# EAGLE board A33 MINI TABLET (EAGLE 9.6.2), part 1 of 4
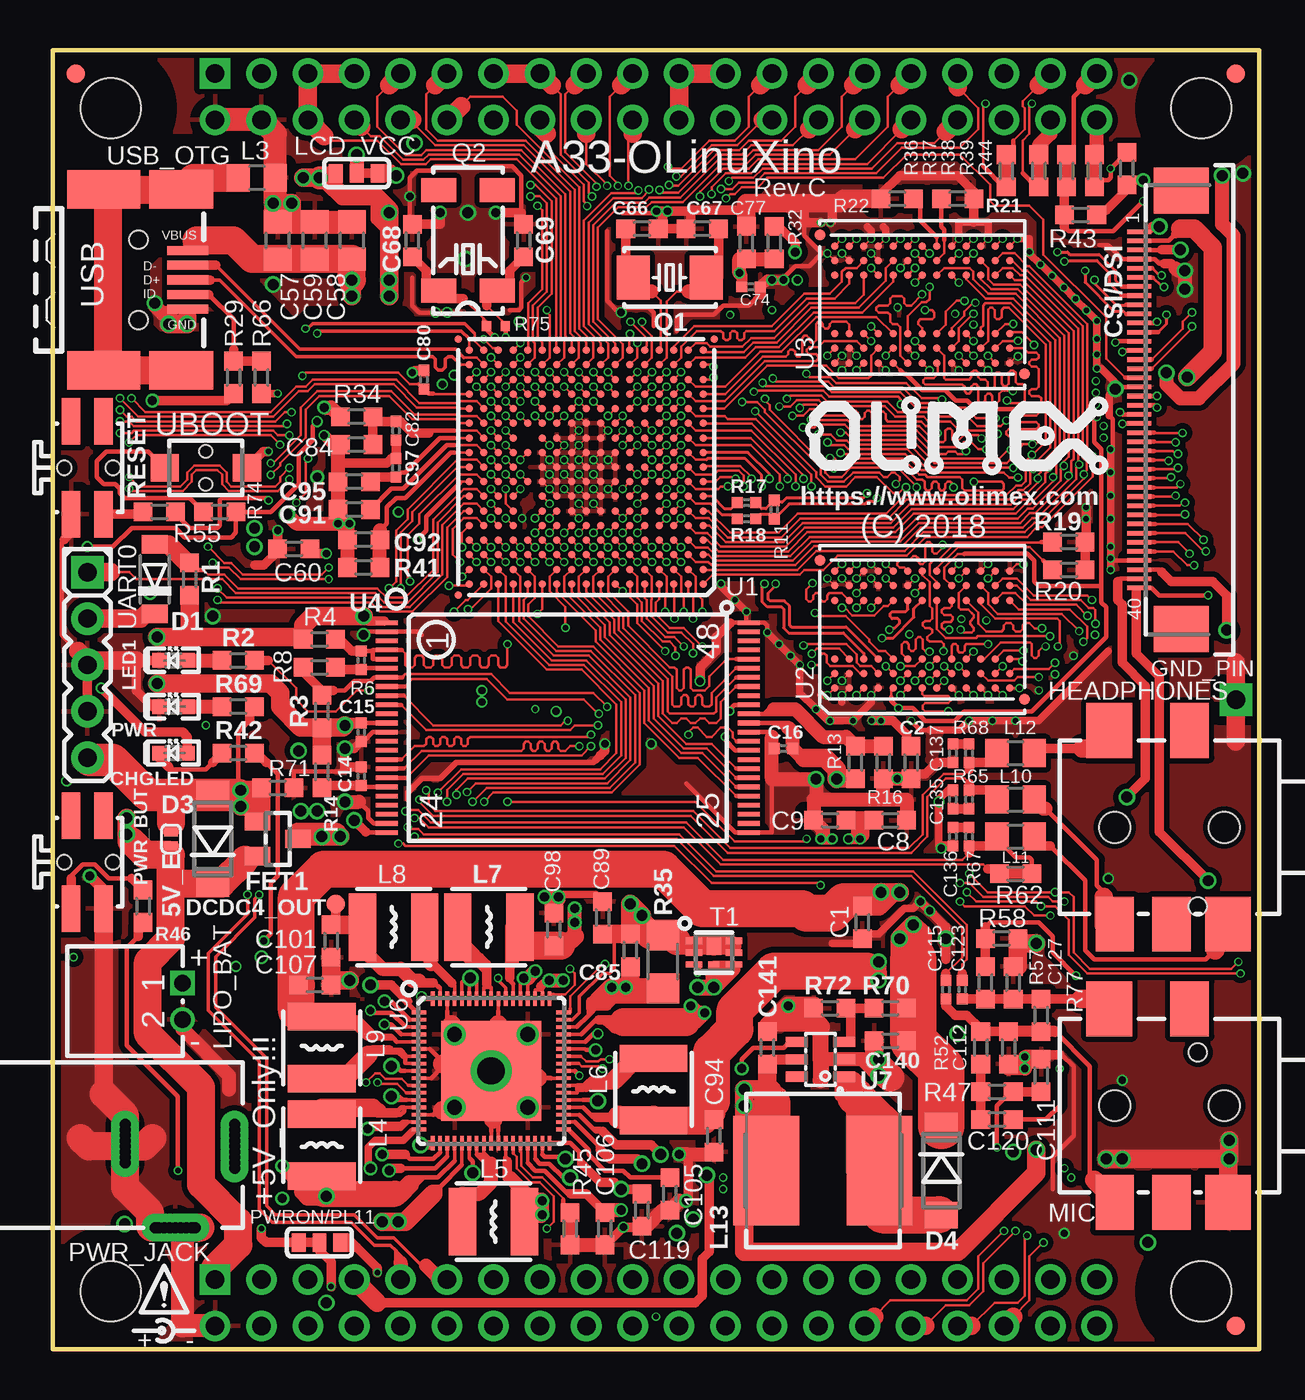
[diagram p5: board, top side]
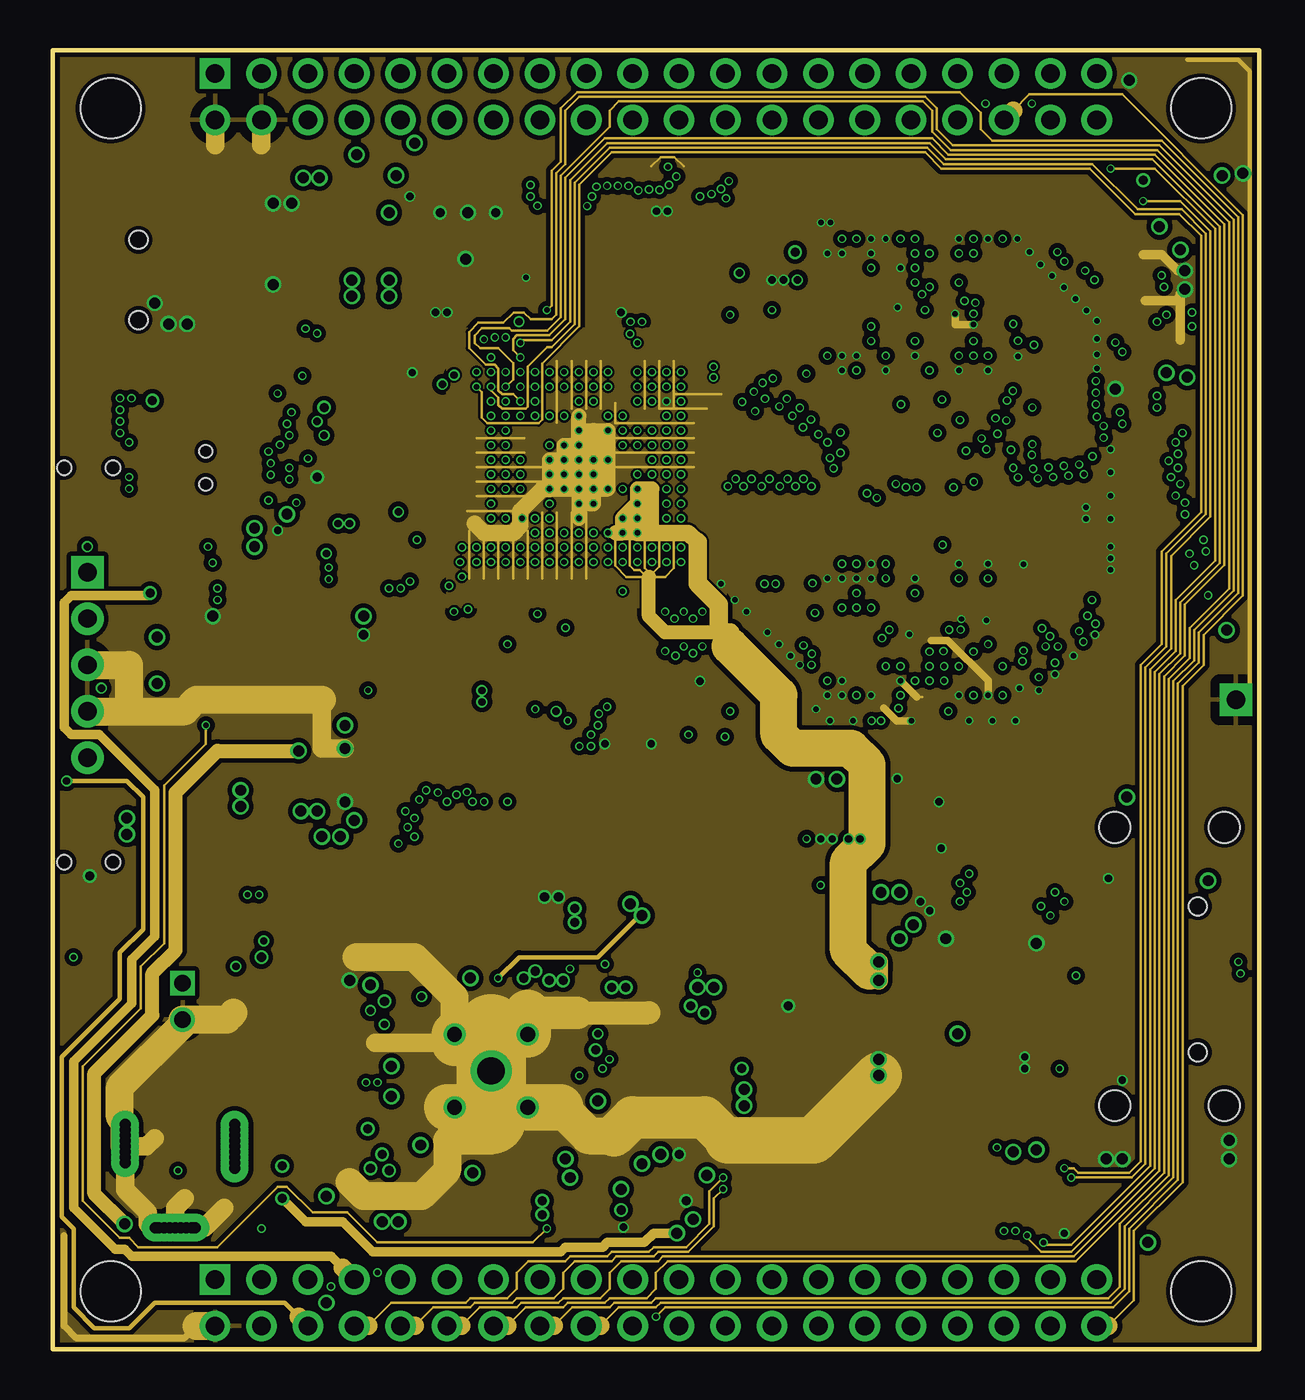
[diagram p6: board, inner layer GND]
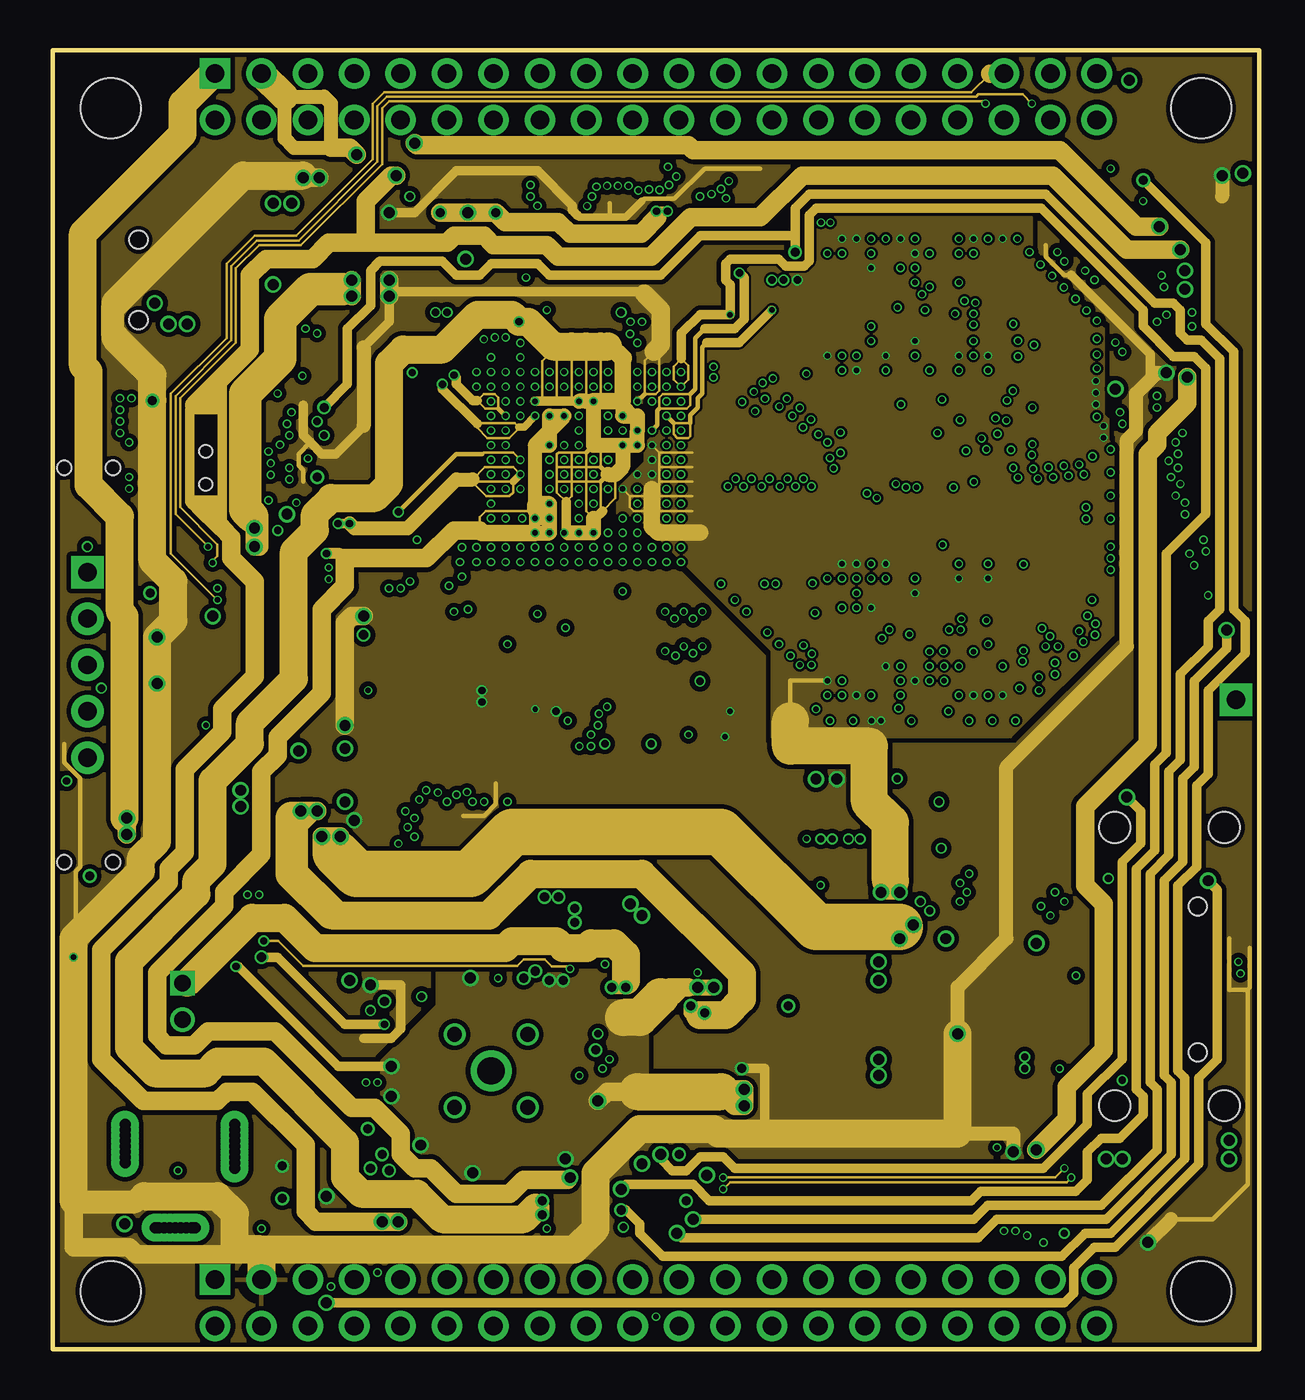
[diagram p7: board, inner layer PWR]
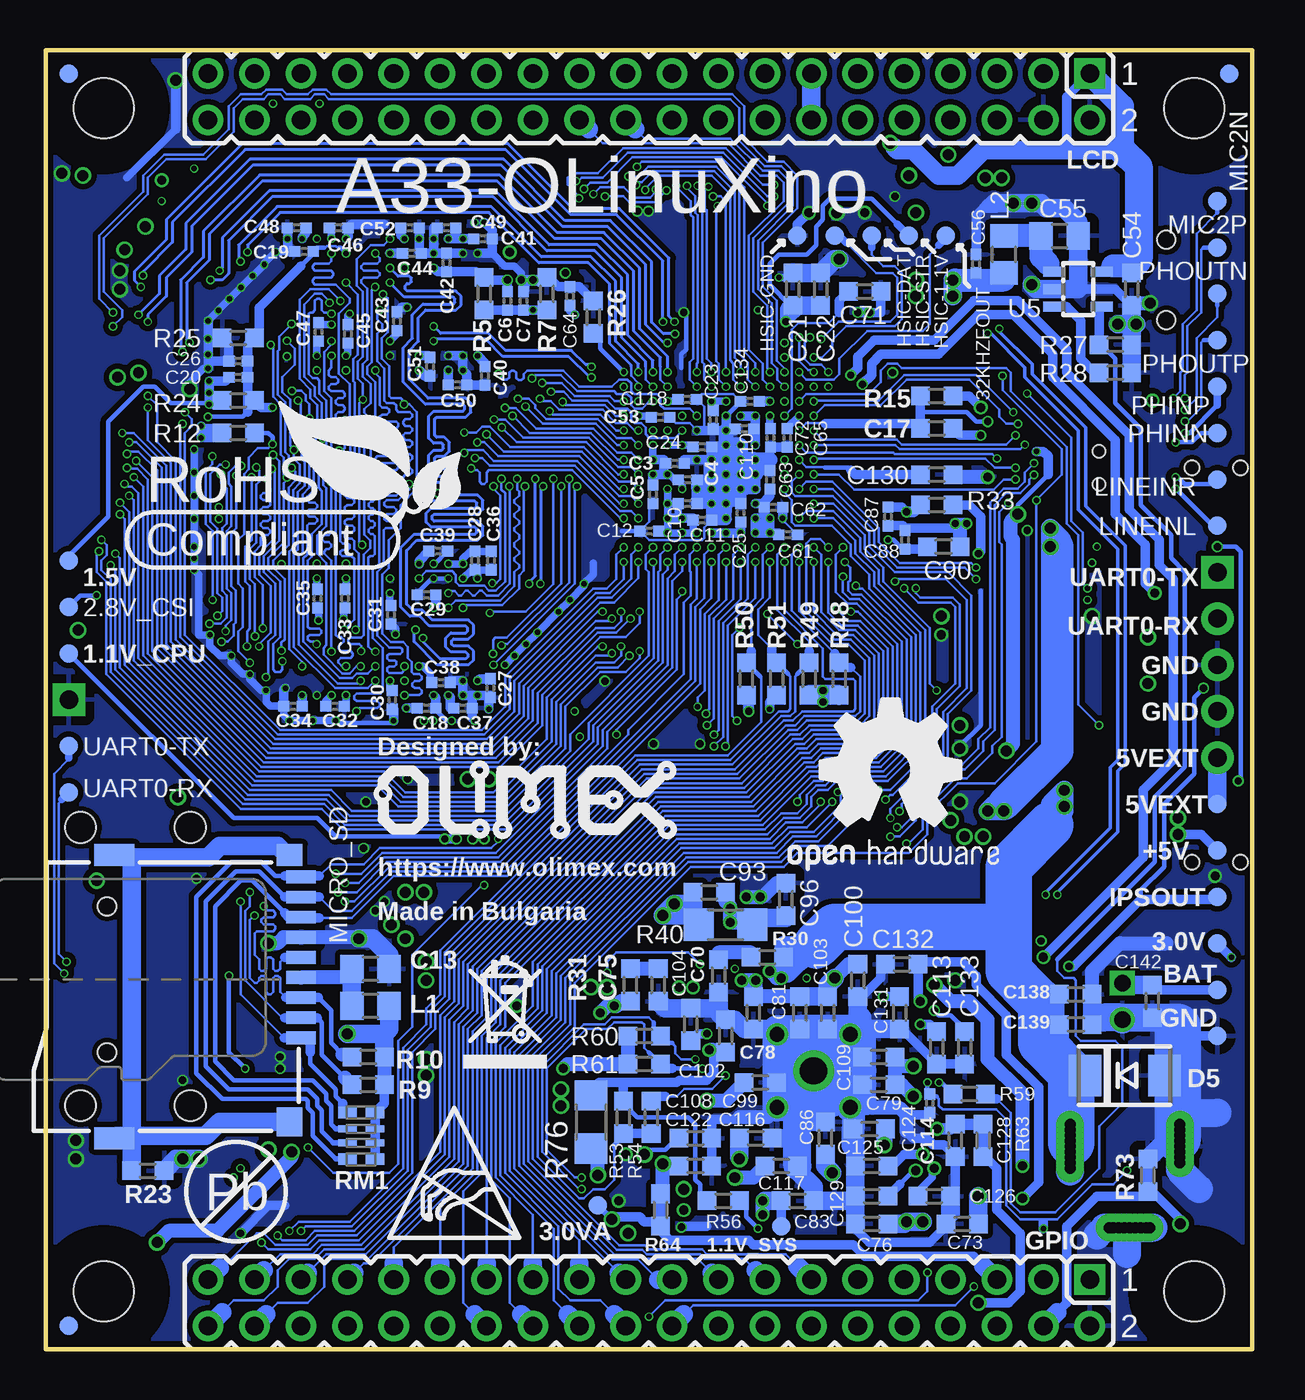
[diagram p8: board, bottom side, seen from below]

Size 66.04 x 71.12 mm. Coordinates in mm from the lower left corner, seen from the top.
Outline: 0,71.12 0,0 66.04,0 66.04,71.12 0,71.12
Copper layers (1+2*15+16): Top 0.035mm / dielectric 5mil / GND 0.035mm / dielectric 1.1mm / PWR 0.035mm / dielectric 5mil / Bottom 0.035mm
Design rules "default": minimum track width 4mil, minimum drill 0.3mm, track to track 5mil, track to pad 5mil, pad to pad 5mil, via to via 5mil, smd to smd 1mil, copper to edge 10mil, drill to drill 8mil, minimum pad ring 8mil, minimum via ring 3mil, stop-mask expansion 4mil, vias tented up to drill 28mil, thermal gap 20mil
Holes 3.3 mm at 3.17,67.94 62.87,67.94 3.17,3.17 62.87,3.17
tRestrict: area 0,64.8 to 6.3,71.1; area 59.7,64.8 to 66,71.1; area 0,0 to 6.3,6.3; area 59.7,0 to 66,6.3; 30 lines
bRestrict: area 0,64.8 to 6.3,71.1; area 59.7,64.8 to 66,71.1; area 0,0 to 6.3,6.3; area 59.7,0 to 66,6.3; 5 lines

## Footprints (pad centres in the part's own frame; a part is rotated, then mirrored left to right if it is on the bottom)
TESTPAD_40-ROUND = smd 1.016 x 1.016: 1 0,0
SJ_1_SMALLER = smd 0.508 x 0.762: 1 -0.381,0; 2 0.381,0
C0603_DWS = smd 1.016 x 1.016: 1 -0.889,0; 2 0.889,0
C0402_TI = smd 0.61 x 0.584: 1 -0.508,0; 2 0.508,0
C0805_5MIL_DWS = smd 1.27 x 1.524: 1 -1.016,0; 2 1.016,0
LED-0603_TEST = smd 0.8 x 0.8: A 0.762,0; C -0.762,0
FPV-WZA21-40-LF = smd 0.25 x 1.3: 1 -9.75,-2.75; 2 -9.25,-2.75; 3 -8.75,-2.75; 4 -8.25,-2.75; 5 -7.75,-2.75; 6 -7.25,-2.75; 7 -6.75,-2.75; 8 -6.25,-2.75; 9 -5.75,-2.75; 10 -5.25,-2.75; 11 -4.75,-2.75; 12 -4.25,-2.75; 13 -3.75,-2.75; 14 -3.25,-2.75; 15 -2.75,-2.75; 16 -2.25,-2.75; 17 -1.75,-2.75; 18 -1.25,-2.75; 19 -0.75,-2.75; 20 -0.25,-2.75; 21 0.25,-2.75; 22 0.75,-2.75; 23 1.25,-2.75; 24 1.75,-2.75; 25 2.25,-2.75; 26 2.75,-2.75; 27 3.25,-2.75; 28 3.75,-2.75; 29 4.25,-2.75; 30 4.75,-2.75; 31 5.25,-2.75; 32 5.75,-2.75; 33 6.25,-2.75; 34 6.75,-2.75; 35 7.25,-2.75; 36 7.75,-2.75; 37 8.25,-2.75; 38 8.75,-2.75; 39 9.25,-2.75; 40 9.75,-2.75 | smd 2.5 x 3: P1 12,-0.45; P2 -12,-0.45
SOD-123 = smd 1 x 1.4: A 1.9,0; C -1.9,0
MLL-41 = smd 1.45 x 1.8: A 2.445,0; K -2.445,0
DO214AA = smd 1.778 x 2.286: A 2.177,0; C -2.177,0
SOT23 = smd 1.4 x 1: 1 1.1,-0.95; 2 1.1,0.95; 3 -1.1,0
TEST_PAD40/70/SQUARE = drill 1.016 pad 1.778 square: P$1 0,0
HN2X20-MALE = drill 1.016 pad 1.676 square: 1 -24.13,-1.27 | drill 1.016 pad 1.676: 2 -24.13,1.27; 3 -21.59,-1.27; 4 -21.59,1.27; 5 -19.05,-1.27; 6 -19.05,1.27; 7 -16.51,-1.27; 8 -16.51,1.27; 9 -13.97,-1.27; 10 -13.97,1.27; 11 -11.43,-1.27; 12 -11.43,1.27; 13 -8.89,-1.27; 14 -8.89,1.27; 15 -6.35,-1.27; 16 -6.35,1.27; 17 -3.81,-1.27; 18 -3.81,1.27; 19 -1.27,-1.27; 20 -1.27,1.27; 21 1.27,-1.27; 22 1.27,1.27; 23 3.81,-1.27; 24 3.81,1.27; 25 6.35,-1.27; 26 6.35,1.27; 27 8.89,-1.27; 28 8.89,1.27; 29 11.43,-1.27; 30 11.43,1.27; 31 13.97,-1.27; 32 13.97,1.27; 33 16.51,-1.27; 34 16.51,1.27; 35 19.05,-1.27; 36 19.05,1.27; 37 21.59,-1.27; 38 21.59,1.27; 39 24.13,-1.27; 40 24.13,1.27
SCJ325P00XG0B02G = smd 2.5 x 3: 1 6.3,-5.3; 2 -0.2,5.3 | smd 2.1 x 3: 3 6,5.3; 4 2.9,5.3; 5 1.9,-5.3 | hole 1.7: 0,0; 6,0
L0805_5MIL_DWS = smd 1.27 x 1.524: 1 -1.016,0; 2 1.016,0
SWPA4018S = smd 1.5 x 3.7: 1 -1.7,0; 2 1.7,0
8X8MM_3131 = smd 3.6 x 6: 1 -3.1,0; 2 3.1,0
SJ_2_SMALL_23_TIED = smd 0.762 x 1.016: 1 -1.143,0; 2 0,0; 3 1.143,0
DW02R = drill 0.9 square: 1 -1,0 | drill 0.9: 2 1,0
TFC-WPAPR-08 = smd 1.6 x 0.7: 1 -6.994,2.25; 2 -6.994,1.15; 3 -6.994,0.05; 4 -6.994,-1.05; 5 -6.994,-2.15; 6 -6.994,-3.25; 7 -6.994,-4.35; 8 -6.994,-5.45; 9 -6.994,-6.55 | smd 1.4 x 1.2: 10 -6.369,-7.75 | smd 1.4 x 1.6: 11 -6.369,6.85 | smd 2.2 x 1.2: 12 3.231,-7.75; 13 3.231,7.75 | hole 1: 3.631,-4.95; 3.631,3.05
SW_TAKT3X4 = smd 2.54 x 1.016: 1_1 2.54,-0.889; 1_2 -2.54,-0.889; 2_1 2.54,0.889; 2_2 -2.54,0.889 | hole 0.8: 0,1.397; 0,-1.27
PWR_JACK_UNI_MILLING = drill 0.6 pad 1.5: + -0.196,4.75; +1 -0.196,5.05; +2 -0.196,5.35; +3 -0.196,5.65; +4 -0.196,4.45; +5 -0.196,4.15; +6 -0.196,3.85; +7 -0.196,3.55; +8 -0.196,5.95; - -6.196,4.75; -1 -6.196,5.05; -2 -6.196,5.35; -3 -6.196,4.45; -4 -6.196,4.15; -5 -6.196,5.65; -6 -6.196,3.85; -8 -6.196,5.95; -- -3.446,0.3; --1 -3.746,0.3; --2 -4.046,0.3; --3 -4.346,0.3; --4 -3.146,0.3; --5 -2.846,0.3; --6 -2.546,0.3; --14 -4.546,0.3; --15 -2.346,0.3
SJ_2_SMALL_12_TIED = smd 0.762 x 1.016: 1 -1.143,0; 2 0,0; 3 1.143,0
HCX-4S = smd 1.8 x 2.4: 1 -2,0; 2 2,0
MC-306 = smd 1.3 x 1.9: 1 -2.75,-1.6; 2 2.75,-1.6; 3 2.75,1.6; 4 -2.75,1.6
R0603_5MIL_DWS = smd 1.016 x 1.016: 1 -0.889,0; 2 0.889,0
R0402_TI = smd 0.61 x 0.584: 1 -0.508,0; 2 0.508,0
R1206_5MIL_WS = smd 1.651 x 1.778: 1 -1.46,0; 2 1.46,0
0603_0R = smd 1.016 x 1.016: 1 -0.889,0; 2 0.889,0
R0402_SMALL = smd 0.5 x 0.55: 1 -0.508,0; 2 0.508,0
R1206_5MIL = smd 1.651 x 1.778: 1 -1.46,0; 2 1.46,0
R_MATRIX_4 = smd 0.635 x 1.016: 1.1 -1.27,-0.762; 1.2 -1.27,0.762; 4.1 1.27,-0.762; 4.2 1.27,0.762 | smd 0.381 x 1.016: 2.1 -0.381,-0.762; 2.2 -0.381,0.762; 3.1 0.381,-0.762; 3.2 0.381,0.762
DFN2*2-6L = smd 0.35 x 0.9: 1 -0.65,-1.1; 2 0,-1.1; 3 0.65,-1.1; 4 0.65,1.1; 5 0,1.1; 6 -0.65,1.1 | smd 0.95 x 0.8: 7 -0.35,0 | smd 0.35 x 0.6: 8 0.65,0
TFBGA282 = smd 0.4 x 0.4: A1 -6.4,-6.4; A2 -6.4,-5.6; A3 -6.4,-4.8; A4 -6.4,-4; A5 -6.4,-3.2; A6 -6.4,-2.4; A7 -6.4,-1.6; A8 -6.4,-0.8; A9 -6.4,0; A10 -6.4,0.8; A11 -6.4,1.6; A12 -6.4,2.4; A13 -6.4,3.2; A14 -6.4,4; A15 -6.4,4.8; A16 -6.4,5.6; A17 -6.4,6.4; B1 -5.6,-6.4; B2 -5.6,-5.6; B3 -5.6,-4.8; B4 -5.6,-4; B5 -5.6,-3.2; B6 -5.6,-2.4; B7 -5.6,-1.6; B8 -5.6,-0.8; B9 -5.6,0; B10 -5.6,0.8; B11 -5.6,1.6; B13 -5.6,3.2; B14 -5.6,4; B15 -5.6,4.8; B16 -5.6,5.6; B17 -5.6,6.4; C1 -4.8,-6.4; C2 -4.8,-5.6; C3 -4.8,-4.8; C4 -4.8,-4; C5 -4.8,-3.2; C6 -4.8,-2.4; C7 -4.8,-1.6; C8 -4.8,-0.8; C9 -4.8,0; C10 -4.8,0.8; C11 -4.8,1.6; C12 -4.8,2.4; C13 -4.8,3.2; C14 -4.8,4; C15 -4.8,4.8; C16 -4.8,5.6; C17 -4.8,6.4; D1 -4,-6.4; D2 -4,-5.6; D3 -4,-4.8; D4 -4,-4; D5 -4,-3.2; D6 -4,-2.4; D7 -4,-1.6; D8 -4,-0.8; D9 -4,0; D10 -4,0.8; D11 -4,1.6; D12 -4,2.4; D13 -4,3.2; D14 -4,4; D15 -4,4.8; D16 -4,5.6; D17 -4,6.4; E1 -3.2,-6.4; E2 -3.2,-5.6; E3 -3.2,-4.8; E4 -3.2,-4; E5 -3.2,-3.2; E6 -3.2,-2.4; E7 -3.2,-1.6; E8 -3.2,-0.8; E9 -3.2,0; E10 -3.2,0.8; E11 -3.2,1.6; E12 -3.2,2.4; E14 -3.2,4; E15 -3.2,4.8; E16 -3.2,5.6; E17 -3.2,6.4; F1 -2.4,-6.4; F2 -2.4,-5.6; F3 -2.4,-4.8; F4 -2.4,-4; F5 -2.4,-3.2; F6 -2.4,-2.4; F7 -2.4,-1.6; F8 -2.4,-0.8; F9 -2.4,0; F10 -2.4,0.8; F11 -2.4,1.6; F12 -2.4,2.4; F14 -2.4,4; F15 -2.4,4.8; F16 -2.4,5.6; F17 -2.4,6.4; FID1 7,-7; FID2 7,7; FID3 -7,7; G1 -1.6,-6.4; G2 -1.6,-5.6; G3 -1.6,-4.8; G4 -1.6,-4; G5 -1.6,-3.2; G6 -1.6,-2.4; G7 -1.6,-1.6; G8 -1.6,-0.8; G9 -1.6,0; G10 -1.6,0.8; G11 -1.6,1.6; G12 -1.6,2.4; G14 -1.6,4; G15 -1.6,4.8; G16 -1.6,5.6; G17 -1.6,6.4; H1 -0.8,-6.4; H2 -0.8,-5.6; H3 -0.8,-4.8; H4 -0.8,-4; H5 -0.8,-3.2; H6 -0.8,-2.4; H7 -0.8,-1.6; H8 -0.8,-0.8; H9 -0.8,0; H10 -0.8,0.8; H11 -0.8,1.6; H12 -0.8,2.4; H13 -0.8,3.2; H14 -0.8,4; H15 -0.8,4.8; H16 -0.8,5.6; H17 -0.8,6.4; J1 0,-6.4; J2 0,-5.6; J3 0,-4.8; J4 0,-4; J5 0,-3.2; J6 0,-2.4; J7 0,-1.6; J8 0,-0.8; J9 0,0; J10 0,0.8; J11 0,1.6; J12 0,2.4; J14 0,4; J15 0,4.8; J16 0,5.6; J17 0,6.4; K1 0.8,-6.4; K2 0.8,-5.6; K3 0.8,-4.8; K4 0.8,-4; K5 0.8,-3.2; K6 0.8,-2.4; K7 0.8,-1.6; K8 0.8,-0.8; K9 0.8,0; K10 0.8,0.8; K11 0.8,1.6; K12 0.8,2.4; K13 0.8,3.2; K14 0.8,4; K15 0.8,4.8; K16 0.8,5.6; K17 0.8,6.4; L1 1.6,-6.4; L2 1.6,-5.6; L3 1.6,-4.8; L4 1.6,-4; L5 1.6,-3.2; L6 1.6,-2.4; L7 1.6,-1.6; L8 1.6,-0.8; L9 1.6,0; L10 1.6,0.8; L11 1.6,1.6; L12 1.6,2.4; L14 1.6,4; L15 1.6,4.8; L16 1.6,5.6; L17 1.6,6.4; M1 2.4,-6.4; M2 2.4,-5.6; M3 2.4,-4.8; M4 2.4,-4; M5 2.4,-3.2; M6 2.4,-2.4; M7 2.4,-1.6; M8 2.4,-0.8; M9 2.4,0; M10 2.4,0.8; M11 2.4,1.6; M12 2.4,2.4; M13 2.4,3.2; M14 2.4,4; M15 2.4,4.8; M16 2.4,5.6; M17 2.4,6.4; N1 3.2,-6.4; N2 3.2,-5.6; N3 3.2,-4.8; N4 3.2,-4; N5 3.2,-3.2; N6 3.2,-2.4; N7 3.2,-1.6; N8 3.2,-0.8; N9 3.2,0; N10 3.2,0.8; N11 3.2,1.6; N12 3.2,2.4; N14 3.2,4; N15 3.2,4.8; N16 3.2,5.6; N17 3.2,6.4; P1 4,-6.4; P2 4,-5.6; P3 4,-4.8; P4 4,-4; P5 4,-3.2; P6 4,-2.4; P7 4,-1.6; P8 4,-0.8; P9 4,0; P10 4,0.8; P11 4,1.6; P12 4,2.4; P13 4,3.2; P14 4,4; P15 4,4.8; P16 4,5.6; P17 4,6.4; R1 4.8,-6.4; R2 4.8,-5.6; R3 4.8,-4.8; R4 4.8,-4; R5 4.8,-3.2; R6 4.8,-2.4; R7 4.8,-1.6; R8 4.8,-0.8; R9 4.8,0; R10 4.8,0.8; R11 4.8,1.6; R12 4.8,2.4; R13 4.8,3.2; R14 4.8,4; R15 4.8,4.8; R16 4.8,5.6; R17 4.8,6.4; T1 5.6,-6.4; T2 5.6,-5.6; T3 5.6,-4.8; T4 5.6,-4; T5 5.6,-3.2; T6 5.6,-2.4; T7 5.6,-1.6; T8 5.6,-0.8; T9 5.6,0; T10 5.6,0.8; T11 5.6,1.6; T12 5.6,2.4; T13 5.6,3.2; T14 5.6,4; T15 5.6,4.8; T16 5.6,5.6; T17 5.6,6.4; U1 6.4,-6.4; U2 6.4,-5.6; U3 6.4,-4.8; U4 6.4,-4; U5 6.4,-3.2; U6 6.4,-2.4; U7 6.4,-1.6; U8 6.4,-0.8; U9 6.4,0; U10 6.4,0.8; U11 6.4,1.6; U12 6.4,2.4; U13 6.4,3.2; U14 6.4,4; U15 6.4,4.8; U16 6.4,5.6; U17 6.4,6.4
FBGA78 = smd 0.4 x 0.4: A1 -4.8,-3.2; A2 -4.8,-2.4; A3 -4.8,-1.6; A7 -4.8,1.6; A8 -4.8,2.4; A9 -4.8,3.2; B1 -4,-3.2; B2 -4,-2.4; B3 -4,-1.6; B7 -4,1.6; B8 -4,2.4; B9 -4,3.2; C1 -3.2,-3.2; C2 -3.2,-2.4; C3 -3.2,-1.6; C7 -3.2,1.6; C8 -3.2,2.4; C9 -3.2,3.2; D1 -2.4,-3.2; D2 -2.4,-2.4; D3 -2.4,-1.6; D7 -2.4,1.6; D8 -2.4,2.4; D9 -2.4,3.2; E1 -1.6,-3.2; E2 -1.6,-2.4; E3 -1.6,-1.6; E7 -1.6,1.6; E8 -1.6,2.4; E9 -1.6,3.2; F1 -0.8,-3.2; F2 -0.8,-2.4; F3 -0.8,-1.6; F7 -0.8,1.6; F8 -0.8,2.4; F9 -0.8,3.2; G1 0,-3.2; G2 0,-2.4; G3 0,-1.6; G7 0,1.6; G8 0,2.4; G9 0,3.2; H1 0.8,-3.2; H2 0.8,-2.4; H3 0.8,-1.6; H7 0.8,1.6; H8 0.8,2.4; H9 0.8,3.2; J1 1.6,-3.2; J2 1.6,-2.4; J3 1.6,-1.6; J7 1.6,1.6; J8 1.6,2.4; J9 1.6,3.2; K1 2.4,-3.2; K2 2.4,-2.4; K3 2.4,-1.6; K7 2.4,1.6; K8 2.4,2.4; K9 2.4,3.2; L1 3.2,-3.2; L2 3.2,-2.4; L3 3.2,-1.6; L7 3.2,1.6; L8 3.2,2.4; L9 3.2,3.2; M1 4,-3.2; M2 4,-2.4; M3 4,-1.6; M7 4,1.6; M8 4,2.4; M9 4,3.2; N1 4.8,-3.2; N2 4.8,-2.4; N3 4.8,-1.6; N7 4.8,1.6; N8 4.8,2.4; N9 4.8,3.2 | smd 0.6 x 0.6: FID1 5.6,-3.8; FID2 -5.6,3.8
TSOP48 = smd 1.2 x 0.25: 1 -9.9,5.75; 2 -9.9,5.25; 3 -9.9,4.75; 4 -9.9,4.25; 5 -9.9,3.75; 6 -9.9,3.25; 7 -9.9,2.75; 8 -9.9,2.25; 9 -9.9,1.75; 10 -9.9,1.25; 11 -9.9,0.75; 12 -9.9,0.25; 13 -9.9,-0.25; 14 -9.9,-0.75; 15 -9.9,-1.25; 16 -9.9,-1.75; 17 -9.9,-2.25; 18 -9.9,-2.75; 19 -9.9,-3.25; 20 -9.9,-3.75; 21 -9.9,-4.25; 22 -9.9,-4.75; 23 -9.9,-5.25; 24 -9.9,-5.75; 25 9.9,-5.75; 26 9.9,-5.25; 27 9.9,-4.75; 28 9.9,-4.25; 29 9.9,-3.75; 30 9.9,-3.25; 31 9.9,-2.75; 32 9.9,-2.25; 33 9.9,-1.75; 34 9.9,-1.25; 35 9.9,-0.75; 36 9.9,-0.25; 37 9.9,0.25; 38 9.9,0.75; 39 9.9,1.25; 40 9.9,1.75; 41 9.9,2.25; 42 9.9,2.75; 43 9.9,3.25; 44 9.9,3.75; 45 9.9,4.25; 46 9.9,4.75; 47 9.9,5.25; 48 9.9,5.75
SOT23-5 = smd 1.2 x 0.55: 1 1.3,-0.95; 2 1.3,0; 3 1.3,0.95; 4 -1.3,0.95; 5 -1.3,-0.95
QFN68-8X8-04 = smd 0.2 x 0.8: 1 -3.2,-3.95; 2 -2.8,-3.95; 3 -2.4,-3.95; 4 -2,-3.95; 5 -1.6,-3.95; 6 -1.2,-3.95; 7 -0.8,-3.95; 8 -0.4,-3.95; 9 0,-3.95; 10 0.4,-3.95; 11 0.8,-3.95; 12 1.2,-3.95; 13 1.6,-3.95; 14 2,-3.95; 15 2.4,-3.95; 16 2.8,-3.95; 17 3.2,-3.95; 35 3.2,3.95; 36 2.8,3.95; 37 2.4,3.95; 38 2,3.95; 39 1.6,3.95; 40 1.2,3.95; 41 0.8,3.95; 42 0.4,3.95; 43 0,3.95; 44 -0.4,3.95; 45 -0.8,3.95; 46 -1.2,3.95; 47 -1.6,3.95; 48 -2,3.95; 49 -2.4,3.95; 50 -2.8,3.95; 51 -3.2,3.95 | smd 0.8 x 0.2: 18 3.95,-3.2; 19 3.95,-2.8; 20 3.95,-2.4; 21 3.95,-2; 22 3.95,-1.6; 23 3.95,-1.2; 24 3.95,-0.8; 25 3.95,-0.4; 26 3.95,0; 27 3.95,0.4; 28 3.95,0.8; 29 3.95,1.2; 30 3.95,1.6; 31 3.95,2; 32 3.95,2.4; 33 3.95,2.8; 34 3.95,3.2; 52 -3.95,3.2; 53 -3.95,2.8; 54 -3.95,2.4; 55 -3.95,2; 56 -3.95,1.6; 57 -3.95,1.2; 58 -3.95,0.8; 59 -3.95,0.4; 60 -3.95,0; 61 -3.95,-0.4; 62 -3.95,-0.8; 63 -3.95,-1.2; 64 -3.95,-1.6; 65 -3.95,-2; 66 -3.95,-2.4; 67 -3.95,-2.8; 68 -3.95,-3.2 | smd 5.49 x 5.49: GND 0,0 | drill 1.5: GND1 0,0 | drill 0.8: GND2 -2,-2; GND3 -2,2; GND4 2,2; GND5 2,-2
SOT23-6 = smd 1.2 x 0.55: 1 1.3,-0.95; 2 1.3,0; 3 1.3,0.95; 4 -1.3,0.95; 5 -1.3,0; 6 -1.3,-0.95
FIDUCIAL-1X3 = smd 1 x 1: 1 0,0
HN1X5 = drill 1 pad 1.778 square: 1 -5.08,0 | drill 1 pad 1.778: 2 -2.54,0; 3 0,0; 4 2.54,0; 5 5.08,0
IT1185AU2 = smd 1.55 x 1.5: 1 -2.25,0; 2 2.25,0 | hole 0.7: 0,-0.9; 0,0.9
USB_MINI_9PIN = smd 2.25 x 0.5: D+ -3.722,0; D- -3.722,-0.8; GND -3.722,1.6; ID -3.722,0.8; VBUS -3.722,-1.6 | smd 4 x 2.1: GND1 0.884,-4.95; GND3 0.884,4.95 | smd 3.5 x 2.1: GND2 -3.366,-4.95; GND4 -3.366,4.95 | hole 1: -1.016,-2.2; -1.016,2.2

## Placement (x,y rotation side)
1.1V_CPU  TESTPADTESTPAD_40-ROUND  [TESTPAD_40-ROUND]  64.77,38.1 0 bottom
1.1V_SYS  TESTPADTESTPAD_40-ROUND  [TESTPAD_40-ROUND]  25.78,6.73 270 bottom
1.5V  TESTPADTESTPAD_40-ROUND  [TESTPAD_40-ROUND]  64.77,43.18 180 bottom
2.8V_CSI  TESTPADTESTPAD_40-ROUND  [TESTPAD_40-ROUND]  64.77,40.64 0 bottom
3.0V  TESTPADTESTPAD_40-ROUND  [TESTPAD_40-ROUND]  1.91,22.23 270 bottom
3.0VA  TESTPADTESTPAD_40-ROUND  [TESTPAD_40-ROUND]  35.81,7.87 0 bottom
5V_E  Open  [SJ_1_SMALLER]  6.48,27.94 270 top
5VEXT  TESTPADTESTPAD_40-ROUND  [TESTPAD_40-ROUND]  1.91,29.84 270 bottom
32KHZFOUT  TESTPADTESTPAD_40-ROUND  [TESTPAD_40-ROUND]  16.76,60.96 180 bottom
+5V  TESTPADTESTPAD_40-ROUND  [TESTPAD_40-ROUND]  1.91,27.3 180 bottom
BAT  TESTPADTESTPAD_40-ROUND  [TESTPAD_40-ROUND]  1.91,19.68 90 bottom
C1  22uF/6.3V  [C0603_DWS]  44.32,23.37 270 top
C2  1uF  [C0603_DWS]  46.99,32.13 90 top
C3  100nF  [C0402_TI]  31.6,48.5 180 bottom
C4  100nF  [C0402_TI]  30.9,47.6 180 bottom
C5  100nF  [C0402_TI]  32.8,46.8 90 bottom
C6  100nF  [C0402_TI]  40.77,57.4 270 bottom
C7  100nF  [C0402_TI]  39.88,57.4 270 bottom
C8  22uF/6.3V  [C0603_DWS]  45.85,28.96 0 top
C9  1uF  [C0603_DWS]  42.55,28.96 180 top
C10  100nF  [C0402_TI]  30.9,46.3 180 bottom
C11  100nF  [C0402_TI]  30.1,45.4 180 bottom
C12  100nF  [C0402_TI]  33,44.8 0 bottom
C13  47uF/6.3V/0805  [C0805_5MIL_DWS]  48.26,20.83 180 bottom
C14  NA(100nF)  [C0402_TI]  16.89,31.37 270 top
C15  NA(100nF)  [C0402_TI]  16.89,33.78 90 top
C16  NA(100nF)  [C0402_TI]  40.01,32.89 0 top
C17  1nF  [C0603_DWS]  17.27,50.42 0 bottom
C18  100nF  [C0402_TI]  45.2,35.1 180 bottom
C19  100nF  [C0402_TI]  51.9,60.1 0 bottom
C20  100nF  [C0402_TI]  55.5,53.21 0 bottom
C21  22uF/6.3V  [C0603_DWS]  25.15,58.04 90 bottom
C22  1uF  [C0603_DWS]  23.62,58.04 90 bottom
C23  100nF  [C0402_TI]  29.5,50.9 90 bottom
C24  100nF  [C0402_TI]  30.1,49.4 180 bottom
C25  100nF  [C0402_TI]  28,45.8 270 bottom
C26  100nF  [C0402_TI]  55.5,54.1 0 bottom
C27  100nF  [C0402_TI]  41.7,36.2 90 bottom
C28  100nF  [C0402_TI]  42.55,43.18 90 bottom
C29  100nF  [C0402_TI]  45.2,41.3 0 bottom
C30  100nF  [C0402_TI]  47.07,35.55 90 bottom
C31  100nF  [C0402_TI]  47.14,40.21 90 bottom
C32  100nF  [C0402_TI]  50.2,35.2 180 bottom
C33  100nF  [C0402_TI]  49.66,41.1 90 bottom
C34  100nF  [C0402_TI]  52.5,35.2 0 bottom
C35  100nF  [C0402_TI]  51.16,41.1 90 bottom
C36  100nF  [C0402_TI]  41.66,43.18 90 bottom
C37  100nF  [C0402_TI]  43.2,35.1 180 bottom
C38  100nF  [C0402_TI]  44.4,36.5 180 bottom
C39  100nF  [C0402_TI]  44.56,43.7 180 bottom
C40  100nF  [C0402_TI]  42,53.3 90 bottom
C41  100nF  [C0402_TI]  42.1,60.8 180 bottom
C42  100nF  [C0402_TI]  44.1,59.5 270 bottom
C43  100nF  [C0402_TI]  46.81,56.29 270 bottom
C44  100nF  [C0402_TI]  46,60 180 bottom
C45  100nF  [C0402_TI]  49.5,55.6 270 bottom
C46  100nF  [C0402_TI]  50,61.4 180 bottom
C47  100nF  [C0402_TI]  51.1,55.7 270 bottom
C48  100nF  [C0402_TI]  52.3,61.4 0 bottom
C49  100nF  [C0402_TI]  44.1,61.4 0 bottom
C50  100nF  [C0402_TI]  43.5,52.8 180 bottom
C51  100nF  [C0402_TI]  45,53.8 90 bottom
C52  100nF  [C0402_TI]  46.1,61.4 180 bottom
C53  100nF  [C0402_TI]  32.38,51.03 180 bottom
C54  22uF/6.3V  [C0603_DWS]  6.6,58.04 270 bottom
C55  47uF/6.3V/0805  [C0805_5MIL_DWS]  10.54,60.96 0 bottom
C56  100nF  [C0402_TI]  15.11,59.44 90 bottom
C57  47uF/6.3V/0805  [C0805_5MIL_DWS]  12.32,60.71 90 top
C58  47uF/6.3V/0805  [C0805_5MIL_DWS]  16.38,60.71 90 top
C59  NA(47uF/6.3V/0805)  [C0805_5MIL_DWS]  14.35,60.71 90 top
C60  22uF/6.3V  [C0603_DWS]  13.21,43.81 180 top
C61  100nF  [C0402_TI]  25.4,44.6 180 bottom
C62  100nF  [C0402_TI]  26.2,46.1 180 bottom
C63  100nF  [C0402_TI]  26.4,47.6 270 bottom
C64  100nF  [C0402_TI]  37.34,57.66 270 bottom
C65  100nF  [C0402_TI]  25.45,49.9 90 bottom
C66  33pF  [C0603_DWS]  32.26,61.34 180 top
C67  33pF  [C0603_DWS]  35.56,61.34 0 top
C68  20pF  [C0603_DWS]  19.68,60.71 270 top
C69  20pF  [C0603_DWS]  25.78,60.71 270 top
C70  10uF/6.3V  [C0603_DWS]  29.21,20.45 90 bottom
C71  10uF/6.3V  [C0603_DWS]  21.21,57.91 0 bottom
C72  100nF  [C0402_TI]  26.38,49.9 270 bottom
C73  10uF/6.3V  [C0603_DWS]  15.88,6.86 0 bottom
C74  100nF  [C0402_TI]  38.23,58.17 0 top
C75  10uF/6.3V  [C0603_DWS]  32.51,19.94 90 bottom
C76  10uF/6.3V  [C0603_DWS]  20.83,6.86 0 bottom
C77  10uF/6.3V  [C0603_DWS]  37.97,60.58 270 top
C78  10uF/6.3V  [C0603_DWS]  27.3,18.41 90 bottom
C79  10uF/6.3V  [C0603_DWS]  20.45,14.48 0 bottom
C80  NA(100nF)  [C0402_TI]  20.32,53.09 270 top
C81  10uF/6.3V  [C0603_DWS]  24.77,18.41 90 bottom
C82  100nF  [C0402_TI]  18.8,50.29 90 top
C83  10uF/6.3V  [C0603_DWS]  24.89,8.13 180 bottom
C84  10uF/6.3V  [C0603_DWS]  16.64,49.53 180 top
C85  1uF  [C0603_DWS]  31.62,21.84 270 top
C86  10uF/6.3V  [C0603_DWS]  23.37,11.56 270 bottom
C87  100nF  [C0402_TI]  19.94,45.59 90 bottom
C88  100nF  [C0402_TI]  19,44.32 270 bottom
C89  10uF/6.3V  [C0603_DWS]  30.1,23.62 270 top
C90  10uF/6.3V  [C0603_DWS]  16.89,43.94 180 bottom
C91  1uF  [C0603_DWS]  16.51,45.97 0 top
C92  10uF/6.3V  [C0603_DWS]  17.02,44.32 0 top
C93  1uF  [C0603_DWS]  29.72,25.02 180 bottom
C94  10uF/6.3V  [C0603_DWS]  36.2,11.68 90 top
C95  10uF/6.3V  [C0603_DWS]  16.51,47.5 0 top
C96  10uF/6.3V  [C0603_DWS]  25.53,24.64 270 bottom
C97  100nF  [C0402_TI]  18.8,48.26 270 top
C98  10uF/6.3V  [C0603_DWS]  27.43,22.99 270 top
C99  10uF/6.3V  [C0603_DWS]  26.92,14.61 180 bottom
C100  10uF/6.3V  [C0603_DWS]  21.59,20.19 90 bottom
C101  NA(10uF/6.3V)  [C0603_DWS]  15.24,22.35 90 top
C102  10uF/6.3V  [C0603_DWS]  28.83,17.14 270 bottom
C103  NA(10uF/6.3V)  [C0603_DWS]  23.24,18.41 90 bottom
C104  1uF  [C0603_DWS]  30.73,17.78 270 bottom
C105  1uF  [C0603_DWS]  33.78,8.51 90 top
C106  10uF/6.3V  [C0603_DWS]  30.23,6.6 90 top
C107  10uF/6.3V  [C0603_DWS]  14.35,19.94 180 top
C108  10uF/6.3V  [C0603_DWS]  30.48,11.56 180 bottom
C109  10uF/6.3V  [C0603_DWS]  20.45,16 0 bottom
C110  100nF  [C0402_TI]  27.8,50.4 0 bottom
C111  1uF  [C0603_DWS]  54.1,14.99 90 top
C112  33pF  [C0603_DWS]  52.32,16.51 90 top
C113  10uF/6.3V  [C0603_DWS]  17.27,16.51 90 bottom
C114  100nF  [C0402_TI]  17.65,13.46 90 bottom
C115  NA(100nF)  [C0402_TI]  48.9,19.68 90 top
C116  10uF/6.3V  [C0603_DWS]  27.18,11.56 180 bottom
C117  10uF/6.3V  [C0603_DWS]  25.78,10.03 180 bottom
C118  100nF  [C0402_TI]  30.93,52 180 bottom
C119  10uF/6.3V  [C0603_DWS]  32.26,7.62 90 top
C120  10uF/6.3V  [C0603_DWS]  51.69,12.57 180 top
C122  10uF/6.3V  [C0603_DWS]  30.48,10.03 180 bottom
C123  100nF  [C0402_TI]  49.78,19.68 90 top
C124  10uF/6.3V  [C0603_DWS]  20.95,12.06 0 bottom
C125  10uF/6.3V  [C0603_DWS]  20.83,10.03 0 bottom
C126  10uF/6.3V  [C0603_DWS]  17.4,8.38 180 bottom
C127  33pF  [C0603_DWS]  52.58,20.07 270 top
C128  10uF/6.3V  [C0603_DWS]  16.26,11.43 90 bottom
C129  10uF/6.3V  [C0603_DWS]  20.83,8.38 0 bottom
C130  10uF/6.3V  [C0603_DWS]  17.27,47.88 180 bottom
C131  NA(10uF/6.3V)  [C0603_DWS]  19.3,18.41 90 bottom
C132  10uF/6.3V  [C0603_DWS]  19.18,21.08 0 bottom
C133  NA(10uF/6.3V)  [C0603_DWS]  15.75,16.51 90 bottom
C134  100nF  [C0402_TI]  27.5,51.9 0 bottom
C135  100nF  [C0402_TI]  49.28,30.1 270 top
C136  100nF  [C0402_TI]  49.28,28.07 90 top
C137  100nF  [C0402_TI]  49.28,32.64 90 top
C138  22uF/6.3V  [C0603_DWS]  9.65,19.43 0 bottom
C139  22uF/6.3V  [C0603_DWS]  9.65,17.78 0 bottom
C140  22uF/6.3V  [C0603_DWS]  45.85,16.89 180 top
C141  22uF/6.3V  [C0603_DWS]  39.12,16.51 270 top
C142  22uF/6.3V  [C0603_DWS]  5.46,19.05 90 bottom
CHGLED  LED/YELLOW/0603  [LED-0603_TEST]  6.6,32.64 0 top
CSI/DSI  FPV-WZA21-40-LF  [FPV-WZA21-40-LF]  62.23,51.44 270 top
D1  1N5819(S4SOD-123)  [SOD-123]  5.59,42.16 90 top
D3  1N5822/SS34/SMA  [MLL-41]  8.76,27.94 90 top
D4  1N5822/SS34/SMA  [MLL-41]  48.64,9.78 270 top
D5  SMBJ6.0A  [DO214AA]  6.99,14.99 0 bottom
DCDC4_OUT  TESTPADTESTPAD_40-ROUND  [TESTPAD_40-ROUND]  15.49,24.38 270 top
FET1  IRLML6402  [SOT23]  12.32,27.94 180 top
GND  TESTPADTESTPAD_40-ROUND  [TESTPAD_40-ROUND]  1.91,17.14 270 bottom
GND_PIN  TESTPAD3  [TEST_PAD40/70/SQUARE]  64.77,35.56 90 top
GPIO  NA(HN2X20)  [HN2X20-MALE]  33.02,2.54 180 bottom
HEADPHONES  SCJ325P00XG0B02G  [SCJ325P00XG0B02G]  64.14,28.57 180 top
HSIC-1.1V  TESTPADTESTPAD_40-ROUND  [TESTPAD_40-ROUND]  18.8,60.96 90 bottom
HSIC-DAT  TESTPADTESTPAD_40-ROUND  [TESTPAD_40-ROUND]  22.86,60.96 90 bottom
HSIC-GND  TESTPADTESTPAD_40-ROUND  [TESTPAD_40-ROUND]  24.89,60.96 90 bottom
HSIC-STR  TESTPADTESTPAD_40-ROUND  [TESTPAD_40-ROUND]  20.83,60.96 90 bottom
IPSOUT  TESTPADTESTPAD_40-ROUND  [TESTPAD_40-ROUND]  1.91,24.77 0 bottom
L1  FB0805/600R/2A  [L0805_5MIL_DWS]  48.26,18.8 180 bottom
L2  FB0805/600R/2A  [L0805_5MIL_DWS]  13.59,59.94 90 bottom
L3  FB0805/600R/2A  [L0805_5MIL_DWS]  11.18,64.14 180 top
L4  SWPA4018S1R5NT(1.5uH/3A/DCR<0.1R)  [SWPA4018S]  14.73,11.18 90 top
L5  SWPA4018S1R5NT(1.5uH/3A/DCR<0.1R)  [SWPA4018S]  24.13,6.99 180 top
L6  SWPA4018S1R5NT(1.5uH/3A/DCR<0.1R)  [SWPA4018S]  32.89,14.22 90 top
L7  SWPA4018S1R5NT(1.5uH/3A/DCR<0.1R)  [SWPA4018S]  23.88,23.11 0 top
L8  NA(SWPA4018S1R5NT(1.5uH/3A/DCR<0.1R))  [SWPA4018S]  18.67,23.11 0 top
L9  SWPA4018S1R5NT(1.5uH/3A/DCR<0.1R)  [SWPA4018S]  14.73,16.51 270 top
L10  FB0805/600R/2A  [L0805_5MIL_DWS]  52.7,30.1 0 top
L11  FB0805/600R/2A  [L0805_5MIL_DWS]  52.7,28.07 0 top
L12  FB0805/600R/2A  [L0805_5MIL_DWS]  52.7,32.64 0 top
L13  2.2uH/3A/YS75/7x8  [8X8MM_3131]  42.16,9.78 0 top
LCD  NA(HN2X20)  [HN2X20-MALE]  33.02,68.58 180 bottom
LCD_VCC  open/close  [SJ_2_SMALL_23_TIED]  16.64,64.39 0 top
LED1  LED/GREEN/0603  [LED-0603_TEST]  6.6,37.72 0 top
LINEINL  TESTPADTESTPAD_40-ROUND  [TESTPAD_40-ROUND]  1.91,45.09 0 bottom
LINEINR  TESTPADTESTPAD_40-ROUND  [TESTPAD_40-ROUND]  1.91,47.62 0 bottom
LIPO_BAT  DW02R  [DW02R]  7.11,19.05 270 top
MIC  SCJ325P00XG0B02G  [SCJ325P00XG0B02G]  64.14,13.34 180 top
MIC2N  TESTPADTESTPAD_40-ROUND  [TESTPAD_40-ROUND]  1.91,62.87 0 bottom
MIC2P  TESTPADTESTPAD_40-ROUND  [TESTPAD_40-ROUND]  1.91,60.33 0 bottom
MICRO_SD  TFC-WPAPR-08  [TFC-WPAPR-08]  59.05,19.3 180 bottom
PHINN  TESTPADTESTPAD_40-ROUND  [TESTPAD_40-ROUND]  1.91,50.16 0 bottom
PHINP  TESTPADTESTPAD_40-ROUND  [TESTPAD_40-ROUND]  1.91,52.7 0 bottom
PHOUTN  TESTPADTESTPAD_40-ROUND  [TESTPAD_40-ROUND]  1.91,57.78 0 bottom
PHOUTP  TESTPADTESTPAD_40-ROUND  [TESTPAD_40-ROUND]  1.91,55.24 0 bottom
PWR  LED/RED/0603  [LED-0603_TEST]  6.6,35.18 0 top
PWR_BUT  SIDE_WTCM-TR(3X4)  [SW_TAKT3X4]  1.91,26.67 270 top
PWR_JACK  PWRJ-2mm(YDJ-1134)  [PWR_JACK_UNI_MILLING]  10.16,6.35 0 top
PWRON/PL11  1-2:Closed/2-3:Opened  [SJ_2_SMALL_12_TIED]  14.61,5.84 0 top
Q1  4SB24.000F20E15/5x3.2mm/20ppm/20pF  [HCX-4S]  33.78,58.67 180 top
Q2  MC-306_32.768KHZ/SMD_8038/12.5pF  [MC-306]  22.73,60.71 90 top
R1  10k  [R0603_5MIL_DWS]  7.49,42.16 270 top
R2  2k/1%  [R0603_5MIL_DWS]  10.16,37.72 180 top
R3  NA(10k)  [R0603_5MIL_DWS]  14.73,34.92 90 top
R4  NA(10k)  [R0603_5MIL_DWS]  14.61,38.86 0 top
R5  2k/1%  [R0603_5MIL_DWS]  42.04,57.78 90 bottom
R6  NA(22R)  [R0402_TI]  16.89,37.72 270 top
R7  2k/1%  [R0603_5MIL_DWS]  38.61,57.78 270 bottom
R8  NA  [R0603_5MIL_DWS]  14.61,37.34 180 top
R9  100k  [R0603_5MIL_DWS]  48.39,14.48 0 bottom
R10  10k  [R0603_5MIL_DWS]  48.39,16 0 bottom
R11  NA  [R0402_TI]  39.5,45.97 270 top
R12  2k/1%  [R0603_5MIL_DWS]  55.5,50.16 0 bottom
R13  NA  [R0603_5MIL_DWS]  43.94,32.13 90 top
R14  NA(10k)  [R0603_5MIL_DWS]  14.73,31.62 270 top
R15  100k  [R0603_5MIL_DWS]  17.27,52.2 180 bottom
R16  NA  [R0603_5MIL_DWS]  45.47,32.13 270 top
R17  22R  [R0402_TI]  37.97,46.35 180 top
R18  22R  [R0402_TI]  37.97,45.47 180 top
R19  243R/1%  [R0603_5MIL_DWS]  55.63,44.2 180 top
R20  NA(243R/1%)  [R0603_5MIL_DWS]  55.63,42.67 180 top
R21  243R/1%  [R0603_5MIL_DWS]  49.53,62.99 180 top
R22  NA(243R/1%)  [R0603_5MIL_DWS]  46.23,62.99 0 top
R23  10k  [R0603_5MIL_DWS]  60.45,9.78 0 bottom
R24  2k/1%  [R0603_5MIL_DWS]  55.5,51.94 180 bottom
R25  2k/1%  [R0603_5MIL_DWS]  55.5,55.37 0 bottom
R26  243R/1%  [R0603_5MIL_DWS]  36.07,56.52 270 bottom
R27  100k  [R0603_5MIL_DWS]  7.49,54.99 180 bottom
R28  6.81k/1%  [R0603_5MIL_DWS]  7.49,53.47 180 bottom
R29  10k  [R0603_5MIL_DWS]  9.91,53.21 90 top
R30  1R  [R0603_5MIL_DWS]  26.54,21.46 0 bottom
R31  1R  [R0603_5MIL_DWS]  34.04,19.94 270 bottom
R32  1R  [R0603_5MIL_DWS]  39.5,60.58 90 top
R33  1R  [R0603_5MIL_DWS]  17.27,46.23 180 bottom
R34  1R  [R0603_5MIL_DWS]  16.64,51.05 0 top
R35  0.01R/1%  [R1206_5MIL_WS]  33.4,21.21 270 top
R36  0R(Board_Mounted)  [0603_0R]  52.2,64.52 270 top
R37  0R(Board_Mounted)  [0603_0R]  53.98,64.52 90 top
R38  0R(Board_Mounted)  [0603_0R]  55.5,64.52 270 top
R39  0R(Board_Mounted)  [0603_0R]  57.02,64.52 90 top
R40  0.01R/1%  [R1206_5MIL_WS]  28.83,23.24 180 bottom
R41  200k/1%  [R0603_5MIL_DWS]  17.02,42.8 180 top
R42  2k/1%  [R0603_5MIL_DWS]  10.16,32.64 0 top
R43  NA(2.2k)  [R0603_5MIL_DWS]  56.26,62.1 180 top
R44  NA(2.2k)  [R0603_5MIL_DWS]  58.8,64.64 270 top
R45  0R(Board_Mounted)  [0603_0R]  28.32,6.6 270 top
R46  2k/1%  [R0603_5MIL_DWS]  4.95,24.26 270 top
R47  1k  [R0603_5MIL_DWS]  51.69,14.1 0 top
R48  2.2k  [R0603_5MIL_DWS]  22.61,36.7 270 bottom
R49  2.2k  [R0603_5MIL_DWS]  24.26,36.7 270 bottom
R50  2.2k  [R0603_5MIL_DWS]  27.69,36.7 270 bottom
R51  2.2k  [R0603_5MIL_DWS]  26.04,36.7 270 bottom
R52  1.5k  [R0603_5MIL_DWS]  50.8,16.51 90 top
R53  NA(10k)  [R0603_5MIL_DWS]  34.42,12.7 90 bottom
R54  1R  [R0603_5MIL_DWS]  32.89,12.7 90 bottom
R55  243R/1%  [R0603_5MIL_DWS]  5.84,45.85 0 top
R56  10k  [R0603_5MIL_DWS]  28.96,8.13 180 bottom
R57  1.5k  [R0603_5MIL_DWS]  51.05,20.07 270 top
R58  1k  [R0603_5MIL_DWS]  51.94,22.48 0 top
R59  243R/1%  [R0603_5MIL_DWS]  15.49,13.97 180 bottom
R60  NA  [R0603_5MIL_DWS]  33.27,17.14 0 bottom
R61  NA  [R0603_5MIL_DWS]  33.27,15.62 0 bottom
R62  0R(Board_Mounted)  [0603_0R]  52.7,26.04 180 top
R63  0R(Board_Mounted)  [0603_0R]  14.73,11.43 90 bottom
R64  0R(Board_Mounted)  [0603_0R]  32.38,7.62 90 bottom
R65  22R  [R0402_TI]  50.16,30.1 90 top
R66  243R/1%  [R0603_5MIL_DWS]  11.43,53.21 270 top
R67  22R  [R0402_TI]  50.16,28.07 270 top
R68  22R  [R0402_TI]  50.16,32.64 270 top
R69  2k/1%  [R0603_5MIL_DWS]  10.16,35.18 180 top
R70  8.25k/1%  [R0603_5MIL_DWS]  45.85,18.67 0 top
R71  100k  [R0603_5MIL_DWS]  12.32,30.73 0 top
R72  1.1k/1%  [R0603_5MIL_DWS]  42.55,18.67 180 top
R73  0R(Board_Mounted)  [0603_0R]  5.71,9.53 270 bottom
R74  6.81k/1%  [R0603_5MIL_DWS]  9.14,45.85 180 top
R75  10M  [R0402_SMALL]  24.26,56.01 0 top
R76  0R  [R1206_5MIL]  36.2,12.45 90 bottom
R77  0R  [R0603_5MIL_DWS]  54.1,18.29 270 top
RESET  SIDE_WTCM-TR(3X4)  [SW_TAKT3X4]  1.91,48.26 270 top
RM1  RA1206_(4X0603)_4B8_100K  [R_MATRIX_4]  48.77,11.68 270 bottom
T1  WPM1481  [DFN2*2-6L]  36.2,21.72 270 top
U1  A33/TFBGA282  [TFBGA282]  29.2,48.3 90 top
U2  MEM4G08D3EABG-125(TFBGA-78_DDR3-1600_11-11-11)  [FBGA78]  47.6,39.4 0 top
U3  MEM4G08D3EABG-125(TFBGA-78_DDR3-1600_11-11-11)  [FBGA78]  47.6,57.2 0 top
U4  NA(MT29F64G08CBABAWP:BTR(8GB_NAND))  [TSOP48]  28.19,34.04 0 top
U5  SY6280(SOT23-5)  [SOT23-5]  9.53,58.04 180 bottom
U6  AXP223  [QFN68-8X8-04]  24,15.24 270 top
U7  MT3608(SOT23-6)  [SOT23-6]  42.04,15.88 0 top
U8  FIDUCIAL  [FIDUCIAL-1X3]  1.27,69.85 90 top
U9  FIDUCIAL  [FIDUCIAL-1X3]  64.77,69.85 180 top
U10  FIDUCIAL  [FIDUCIAL-1X3]  64.77,69.85 0 bottom
U11  FIDUCIAL  [FIDUCIAL-1X3]  64.77,1.27 90 top
U12  FIDUCIAL  [FIDUCIAL-1X3]  64.77,1.27 180 bottom
U13  FIDUCIAL  [FIDUCIAL-1X3]  1.27,69.85 0 bottom
U$2  [LOGO-OPENHARDWARE_8X8]  19.81,31.62 0 bottom
U$3  [ATTENTION_SMALL]  4.83,2.03 0 top
U$6  [OLIMEX1_V]  30.35,27.81 0 bottom
U$8  [OLIMEX1_V]  58.93,47.75 0 top
U$9  [PB]  55.63,8.64 0 bottom
U$10  [ESD_SYMBOL]  47.24,6.1 0 bottom
U$11  [RECYCLE_BIN1/8]  43.18,15.37 0 bottom
U$12  [ROHS]  60.58,43.43 0 bottom
UART0  HN1X5  [HN1X5]  1.91,37.47 270 top
UART0-RX  TESTPADTESTPAD_40-ROUND  [TESTPAD_40-ROUND]  64.77,30.48 180 bottom
UART0-TX  TESTPADTESTPAD_40-ROUND  [TESTPAD_40-ROUND]  64.77,33.02 180 bottom
UBOOT  IT1185AU2  [IT1185AU2]  8.38,48.26 180 top
USB_OTG  USB-OTG  [USB_MINI_9PIN]  3.68,58.55 180 top

## Tracks (layer width: path | path; a pad name or v marks a point on that pad's centre or on a via)
1.1V_CPUS  (via drill 0.3, 0.4, 0.5)
  Top 0.127: v24.8,51.1 U1.M14
  Top 0.203: 19.08,17.24 U6.4
  Top 0.254: 19.08,17.24 18.54,17.78 v18.16,17.78
  PWR 0.127: 23.24,51.94 23.68,51.5 24.4,51.5 24.4,52.1 24.2,52.3 23.6,52.3 23.24,51.94
  PWR 0.254: 24.4,51.5 v24.8,51.1
  PWR 0.508: 23.24,51.94 22.99,51.94 22.1,52.83 22.1,53.21 v21.97,53.34 | v18.16,17.78 16,17.78 12.32,21.46 v11.43,21.46
  Bottom 0.254: 25.45,50.45 C65.2
  Bottom 0.406: v24.8,51.1 25.45,50.45
  Bottom 0.508: v18.16,17.78 17.65,17.78 C113.2 | v11.43,21.46 5.97,26.92 5.97,30.61 4.32,32.26 4.32,42.16 5.08,42.93 5.08,44.32 6.73,45.97 6.73,50.04 10.16,53.47 10.16,54.74 12.83,57.4 15.24,57.4 17.4,55.24 20.7,55.24 21.59,54.36 21.59,53.72 v21.97,53.34
1.8V_DVDD-CSI  (via drill 0.5, 0.6)
  Top 0.203: 19.55,18.04 U6.2
  Top 0.254: CSI/DSI.38 60.57,42.69 60.71,42.55 | 19.55,18.04 18.54,19.05 v18.16,19.05
  Top 0.508: 60.71,42.55 61.21,42.04 63.5,42.04 64.26,41.27 v64.26,39.37
  GND 0.508: v12.57,8.26 13.84,6.99 15.88,6.99 17.53,5.33 27.81,5.33 28.07,5.59 30.1,5.59 30.35,5.84 32.38,5.84 32.89,6.35 v34.16,6.35
  PWR 0.508: v64.26,39.37 64.26,38.35 62.48,36.58 62.48,31.88 61.85,31.24 61.85,26.67 60.83,25.65 60.83,14.99 61.21,14.61 61.21,10.67 57.66,7.11 51.69,7.11 50.67,6.1 34.42,6.1 v34.16,6.35
  Bottom 0.508: v18.16,19.05 18.29,19.18 C132.2 18.16,21.21 15.88,21.21 15.11,20.45 15.11,19.94 13.46,18.29 13.46,16.13 11.68,14.35 11.68,9.14 v12.57,8.26
2.5V_ALDO2  (via drill 0.3, 0.6)
  Top 0.127: v34.4,52.7 U1.P3
  Top 0.203: U6.34 27.22,11.3 27.3,11.3
  Top 0.254: 27.3,11.3 28.32,11.3 28.83,10.79 28.83,10.46 | 28.83,10.46 28.83,10.11 28.91,10.03 29.08,10.03 29.08,10.21 28.83,10.46
  Top 0.508: 29.08,10.03 29.97,9.14 30.73,9.14 v31.11,8.76 32.26,8.76 C119.2
  PWR 0.127: 34.8,53.1 v34.4,52.7 34,53.1 34,53.81 34.42,54.23 34.8,53.85 34.8,53.1
  PWR 0.508: v31.11,8.76 31.37,9.02 35.05,9.02 35.94,8.13 50.29,8.13 50.8,8.64 56.01,8.64 56.64,9.27 56.64,10.79 57.4,11.56 58.42,11.56 59.69,12.83 59.69,13.84 59.31,14.22 59.31,26.29 60.33,27.3 60.33,32 60.96,32.64 60.96,43.56 63.12,45.72 63.12,53.72 62.48,54.36 61.34,54.36 59.69,56.01 59.69,56.9 54.1,62.48 41.78,62.48 41.4,62.1 41.4,59.56 41.15,59.31 40.13,59.31 39.75,59.69 37.08,59.69 36.83,59.44 36.83,58.55 37.08,58.29 v37.08,56.64 35.43,56.64 34.42,55.63 34.42,54.23
  Bottom 0.508: C64.2 37.34,56.9 v37.08,56.64
2.8V_AVDD-CSI  (via drill 0.6)
  Top 0.203: 28.82,12.84 U6.37
  Top 0.254: 58.29,42.04 58.44,42.19 CSI/DSI.39 | 29.59,12.06 29.72,11.94 30.1,11.94 29.97,12.06 29.59,12.06 | 29.59,12.06 28.82,12.84
  Top 0.508: v58.8,30.23 59.82,31.24 59.82,36.32 58.55,37.59 58.55,40.77 58.29,41.02 58.29,42.04 | 30.1,11.94 30.86,11.18 32.77,11.18 v33.27,10.67
  PWR 0.508: v58.8,30.23 59.56,29.46 59.56,27.69 58.55,26.67 58.55,15.88 56.64,13.97 56.64,12.32 54.23,9.91 37.34,9.91 36.7,10.54 35.43,10.54 34.67,9.78 33.91,9.78 33.27,10.41 v33.27,10.67
  Bottom 0.254: C108.2 31.5,11.56 32.13,10.92 33.02,10.92 v33.27,10.67
3.0V_ALDO1  (via drill 0.3, 0.4, 0.6)
  Top 0.127: v27.2,51.1 U1.N11 | v28,51.1 U1.M11 | v27.2,49.5 U1.L12 | v27.2,44.7 U1.E11 | v26.4,44.7 U1.E12 | v27.2,45.5 U1.F11 | v26.4,45.5 U1.F12 | v27.2,46.3 U1.G12
  Top 0.203: 26.4,10.43 U6.32
  Top 0.254: v28.32,9.4 27.94,9.4 27.18,10.16 26.67,10.16 26.4,10.43
  Top 0.508: C60.1 14.1,43.56 v14.99,43.56
  PWR 0.127: 23.37,44.83 23.37,45.57 23.7,45.9 26.4,45.9
  PWR 0.61: v14.99,43.56 15.75,43.56 16,43.31 | v26.4,44.7 v26.4,45.5 | v26.4,45.5 26.5,45.5 | v26.4,45.5 26.4,45.9
  PWR 0.762: 26.42,46.3 26.42,49.48 | 28.19,9.27 v28.32,9.4
  PWR 0.813: v26.4,44.7 v27.2,44.7 v27.2,45.5 | v27.2,45.5 26.5,45.5 | v27.2,45.5 v27.2,46.3 26.42,46.3 26.4,46.3 26.4,45.9 | 27.2,50.3 v27.2,49.5 26.42,49.5 | 27.2,50.3 v27.2,51.1 v28,51.1 27.2,50.3 | 26.42,49.48 26.42,49.5 | 26.42,49.5 26.42,49.52 27.2,50.3
  PWR 0.914: 23.37,44.83 23.5,44.7 v26.4,44.7
  PWR 1.016: 23.37,44.83 21.97,44.83 20.45,43.31 16,43.31 16,41.78 14.73,40.51 14.73,35.94 12.32,33.53 12.32,32.51 11.43,31.62 11.43,27.08 9.4,25.04 9.4,24.28 5.71,20.6 5.71,17.14 6.22,16.64 7.75,16.64 8.51,17.4 12.19,17.4 16.38,13.21 17.63,13.21 19.05,11.79 19.05,10.67 19.81,9.91 20.7,9.91 22.1,8.51 25.02,8.51 25.78,9.27 28.19,9.27
  Bottom 0.508: v14.99,43.56 14.86,43.69 14.86,45.59 15.49,46.23 R33.1 | v27.2,46.3 26.8,46.3 | 26.8,46.3 26.71,46.3 C62.2 26.71,45.5 | C63.2 26.4,46.7 26.8,46.3 | C61.2 25.91,44.7 v26.4,44.7 | v26.4,44.7 v27.2,44.7 27.2,45.1 | v26.4,44.7 26.4,45.1 | 26.4,45.1 v26.4,45.5 26.71,45.5 | 27.2,45.1 v27.2,45.5 26.71,45.5 | 26.4,45.1 27.2,45.1 | 27.2,50.4 C110.2 | v27.2,49.5 27.2,50.4 | 27.2,50.4 v27.2,51.1 v28,51.1
  Bottom 0.762: C117.2 27.3,9.4 v28.32,9.4
3.3V_CTP  (via drill 0.5)
  Top 0.203: 26,10.19 U6.31
  Top 0.254: 28.07,8.64 28.19,8.51 28.37,8.51 28.25,8.64 28.07,8.64 | 28.07,8.64 26.92,9.78 26.42,9.78 26,10.19
  Top 0.508: R43.1 57.15,62.36 57.66,62.36 58.8,63.5 R44.2 58.8,64.01 v59.69,64.01 | 28.37,8.51 29.21,8.51 C106.2
  Top 0.762: C106.2 30.23,7.62 v31.11,7.62
  PWR 0.508: v31.11,7.62 31.37,7.62 32.13,6.86 32.13,6.35 33.4,5.08 55.24,5.08 56.52,6.35 57.91,6.35 61.98,10.41 61.98,14.86 61.59,15.24 61.59,25.4 62.61,26.42 62.61,30.86 63.25,31.5 63.25,36.07 65.28,38.1 65.28,39.88 64.64,40.51 64.64,54.61 63.12,56.13 63.12,60.58 v59.69,64.01
+5V  (via drill 0.6)
  Top 0.254: 60.07,61.34 59.91,61.19 CSI/DSI.1
  Top 0.508: v60.58,61.47 60.2,61.47 60.07,61.34 | 6.48,27.05 5V_E.2
  Top 1.016: v4.06,29.08 v4.06,28.19 4.06,28.07 4.32,27.81 | FET1.2 10.73,26.99 10.54,26.8
  Top 1.524: GPIO.1 8.89,4.45 10.16,5.71 10.16,6.99 8.13,9.02 8.13,14.35 5.21,17.27 5.21,21.21 6.48,22.48 6.48,25.4 | 6.48,25.4 6.48,27.05 5.08,27.05 4.32,27.81 | 6.48,25.4 6.57,25.5 D3.K 9.24,25.5 10.54,26.8
  PWR 1.016: v60.58,61.47 59.31,61.47 55.12,65.66 35.05,65.66 34.8,65.91 19.94,65.91 v19.81,66.04 | 3.94,29.08 v4.06,29.08 v4.06,28.19
  PWR 1.524: 3.94,29.08 3.94,40.13 3.68,40.39 3.68,45.59 1.97,47.31 1.97,53.53 1.65,53.85 1.65,61.09 7.11,66.55 7.11,68.2 8.76,69.85 LCD.1
  Bottom 0.508: U5.5 7.91,59.31 7.62,59.31 | LCD.1 10.16,68.58 10.16,65.66 | +5V.1 2.79,28.19 v4.06,28.19
  Bottom 0.762: 19.56,65.79 v19.81,66.04
  Bottom 1.016: 7.11,65.66 10.16,65.66 14.73,65.66 16.13,64.26 17.14,64.26 18.54,65.66 19.43,65.66 19.56,65.79 | 6.6,59.05 C54.1
  Bottom 1.27: LCD.1 7.11,68.07 7.11,65.66 | 6.6,59.05 6.6,59.31 7.62,59.31
  Bottom 1.524: 6.6,59.31 6.22,59.69 6.22,64.77 7.11,65.66
+5V_OTG_PWR  (via drill 0.5, 0.6)
  Top 0.203: 28.92,17.24 U6.48
  Top 0.254: 28.92,17.24 29.72,18.03 29.9,18.03
  Top 0.508: USB_OTG.VBUS 7.41,60.71 7.87,60.71 | 30.23,18.03 29.9,18.03 | 30.23,18.03 30.61,18.03 30.86,17.78 30.48,17.78 30.23,18.03
  Top 0.762: 34.92,17.91 34.67,17.91 | 34.92,17.91 35.18,17.91 v35.69,18.41 35.31,18.41 v34.92,18.8 34.92,17.91
  Top 1.016: v16.38,57.66 v16.38,58.55 | 31.24,17.91 31.11,17.78 30.86,17.78
  Top 1.524: v16.38,58.55 C58.1 C59.1 C57.1 10.92,59.69 9.91,60.71 7.87,60.71 | 34.67,17.91 31.24,17.91
  PWR 0.762: 35.43,18.29 35.43,18.41 | 35.43,18.41 v35.69,18.41 | 35.43,18.41 34.92,18.41 v34.92,18.8
  PWR 1.016: 13.08,29.08 13.08,29.46 v13.59,29.46 14.22,29.46 | 15.88,58.04 16.38,58.04 | 16.38,58.04 v16.38,57.66 | v11.05,44.96 v11.05,43.94 11.3,43.94 11.3,45.59 10.92,45.59 11.05,45.47 v11.05,44.96 | v11.05,44.96 11.18,44.96 | 14.22,29.46 v14.48,29.46 | 14.22,29.46 13.46,28.7 13.08,28.7 | 16.38,58.04 v16.38,58.55
  PWR 1.524: 15.24,23.88 15.37,23.75 23.88,23.75 26.16,26.04 32.26,26.04 37.72,20.57 37.72,19.18 36.83,18.29 35.43,18.29
  PWR 1.778: 15.24,23.88 13.08,26.04 13.08,28.7 13.08,29.08 | 10.92,45.59 10.54,45.97 10.54,52.32 12.45,54.23 12.45,56.39 14.1,58.04 15.88,58.04
  Bottom 0.508: 15.11,58.55 C56.1
  Bottom 0.762: v35.69,18.41 35.31,18.8 v34.92,18.8 34.8,18.8 34.54,19.05 R31.2
  Bottom 1.016: v16.38,57.66 v16.38,58.55 16.26,58.55 | v13.59,29.46 13.59,29.84 14.1,29.84 v14.48,29.46 v13.59,29.46 | 10.67,43.94 v11.05,43.94 v11.05,44.96 10.41,44.32 10.41,43.94 10.67,43.94
  Bottom 1.27: L2.1 13.59,58.55 15.11,58.55 16.26,58.55
  Bottom 1.778: 13.59,29.84 10.67,32.77 10.67,43.94
+15V  (via drill 0.5, 0.6)
  Top 0.203: 25.6,20.32 U6.56 | 26,20.32 U6.55
  Top 0.254: 25.6,20.32 v25.78,20.32 26,20.32 | 10.79,34.42 10.16,33.78 10.16,30.61 v10.29,30.61
  Top 0.508: 10.79,34.42 10.79,35.18 R69.1 | 6.48,28.83 5V_E.1
  Top 0.762: v26.42,20.7 26.04,20.32 v25.78,20.32
  Top 1.016: 8.76,30.35 D3.A | FET1.1 11.43,28.89 11.43,29.72 | 11.43,29.72 11.43,30.61 | 11.43,30.61 R71.1 | 11.43,30.61 v10.29,30.61 10.29,30.35 | 11.43,29.72 v10.29,29.72 10.29,30.35 | 10.29,30.35 10.16,30.35
  Top 1.524: 6.48,30.35 6.48,28.83
  Top 1.778: UART0.5 2.03,32.26 3.3,32.26 5.21,30.35 6.48,30.35 8.76,30.35 10.16,30.35
  Bottom 0.762: 25.65,20.57 25.65,20.45 | 25.65,20.45 v25.78,20.32 26.04,20.32 v26.42,20.7 25.65,20.7 | 24.77,21.21 24.77,21.08 25.4,20.45 25.65,20.45
  Bottom 1.016: 25.65,21.21 R30.2 25.65,22.1 23.88,22.1 24.77,21.21 25.65,21.21 | 25.65,21.21 25.65,20.7 25.65,20.57 | 11.56,16.76 10.54,16.76 C139.1 | 12.06,19.43 C138.1 | UART0.5 1.91,30.99 5VEXT.1 | v10.29,30.61 v10.29,29.72 10.29,29.46 11.05,28.7 11.05,29.84 v10.29,30.61
  Bottom 1.524: 9.78,14.99 D5.C | 9.96,9.72 PWR_JACK.+ 9.91,11.1 9.91,11.3
  Bottom 2.54: 13.34,23.11 13.34,20.7 12.06,19.43 11.56,18.92 11.56,16.76 9.91,15.11 | 13.34,23.11 22.86,23.11 23.88,22.1 | 13.34,23.11 13.34,26.42 11.05,28.7 | 9.91,15.11 9.78,14.99 | 9.91,11.3 9.91,15.11
+24V  (via drill 0.5)
  Top 0.203: 28.69,17.64 U6.49
  Top 0.254: 29.34,18.29 28.69,17.64 | 29.46,18.67 29.34,18.54 29.34,18.29 | 29.34,18.29 29.84,18.8 29.84,19.05
  Top 0.508: 29.84,19.05 29.46,19.05 29.46,18.8 | 29.46,18.8 29.46,18.67 | v31.37,19.81 30.73,19.18 | 30.73,19.18 30.35,18.8 29.46,18.8 | 33.15,19.81 32.51,19.18 30.73,19.18
  Top 1.016: 31.62,19.81 v31.37,19.81 v30.61,19.81 29.84,19.05 | 31.62,19.81 33.15,19.81 33.34,19.81 R35.2 | 31.62,19.81 C85.2
  PWR 0.635: 31.37,20.19 v31.37,19.81
  PWR 0.762: v31.37,19.81 v30.61,19.81
  PWR 1.016: LIPO_BAT.1 7.35,20.05 7.37,20.07
  PWR 1.524: 31.37,20.19 31.37,21.59 30.73,22.23 29.46,22.23 29.21,21.97 27.94,21.97 27.56,22.35 25.15,22.35 24.77,21.97 14.35,21.97 12.7,23.62 10.92,23.62 7.37,20.07
  Bottom 0.508: C142.2 5.46,19.68 BAT.1
  Bottom 1.016: LIPO_BAT.1 7,19.94 C142.2
ALDO3  (via drill 0.6)
  Top 0.203: 28.58,12.44 U6.36
  Top 0.254: 29.84,11.18 29.84,11.05 29.97,10.92 29.97,11.05 29.84,11.18 | 29.84,11.18 28.58,12.44
  Top 0.508: v32.26,10.16 32,10.41 30.48,10.41 29.97,10.92
  Bottom 0.762: R64.2 32.26,8.64 v32.26,10.16 31.5,10.16 C122.2
AXP-NMI#  (via drill 0.3)
  Top 0.127: v24.8,51.9 U1.N14 | v27.05,6.6 27.43,6.99 27.43,8.38 26.67,9.14 26.16,9.14 25.4,9.91 25.4,10.54 25.2,10.74
  Top 0.203: 25.2,10.74 U6.29
  GND 0.127: v27.05,6.6 26.29,5.84 17.78,5.84 16.13,7.49 14.22,7.49 12.83,8.89 12.32,8.89 9.02,5.59 4.7,5.59 4.19,6.1 3.68,6.1 1.65,8.13 1.65,15.49 4.83,18.67 4.83,20.95 6.1,22.23 6.1,30.86 8.38,33.15 v8.38,34.16
  Bottom 0.127: v24.8,51.9 24.4,52.3 20.98,52.3 20.32,52.96 20.32,53.59 19.94,53.98 19.43,53.98 19.18,53.72 13.46,53.72 13.21,53.47 13.21,52.45 10.16,49.4 10.16,45.21 9.53,44.58 9.53,35.31 v8.38,34.16
  Bottom 0.254: R56.1 27.69,8.13 27.69,7.24 v27.05,6.6
AXP-RESET#  (via drill 0.3)
  Top 0.127: v13.66,53.29 13.84,53.47 18.92,53.47 19.56,52.83 20.07,52.83 | U1.P17 20.85,52.3 20.83,52.32
  Top 0.254: v11.81,46.48 11.68,46.61 9.27,46.61 9.14,46.48 9.14,45.09 9.02,44.96 7.49,44.96 6.73,45.72 R55.2 | 20.83,52.32 20.57,52.32 C80.2 20.07,52.83
  Bottom 0.127: 34.92,11.05 34.92,9.27 35.43,8.76 36.07,8.76 36.58,8.26 36.83,8.26 39.12,10.54 39.12,15.62 37.08,17.65 37.08,20.07 30.73,26.42 25.65,26.42 24.89,27.18 18.8,27.18 17.78,28.19 17.78,29.34 16.13,30.99 14.1,30.99 11.81,33.27 v11.81,46.48 10.41,47.88 10.41,49.28 13.66,52.53 v13.66,53.29
  Bottom 0.254: 34.92,11.05 34.92,11.18 34.42,11.68 R53.1
  Bottom 0.508: R54.1 R53.1
AXP_PWRON  (via drill 0.3)
  Top 0.127: 19.36,14.04 18.87,14.53 17.96,14.53 17.88,14.61 v17.78,14.61
  Top 0.203: 19.36,14.04 U6.12
  Top 0.254: 4.7,22.61 4.06,21.97 4.06,16.64 6.86,13.84 v6.86,9.78
  Top 0.508: 4.7,22.61 4.7,23.11 R46.2 | PWRON/PL11.1 11.68,5.84 11.43,6.1 v11.43,6.6
  Bottom 0.127: 11.24,7.11 10.67,7.11 8.76,9.02 7.62,9.02 v6.86,9.78 | 11.24,7.11 11.3,7.11 | 11.3,7.11 11.43,7.11 | 11.43,7.11 11.43,6.86 | 11.43,7.11 11.56,7.11 | 11.56,7.11 11.62,7.11 | 11.62,7.11 12.7,7.11 13.46,7.87 13.46,12.57 14.02,13.13 16.94,13.13 17.14,13.34 17.14,13.72 17.27,13.84 | 11.56,7.11 11.56,6.86 | 11.3,7.11 11.3,6.86 | 11.24,7.11 11.24,6.86 | 11.62,7.11 11.62,6.86
  Bottom 0.254: v17.78,14.61 17.78,14.1 C114.2 17.65,13.84 17.27,13.84
  Bottom 0.508: 11.43,6.86 v11.43,6.6
CHGLED  (via drill 0.3, 0.4)
  Top 0.127: 27.43,19.43 28.07,19.43 28.57,19.94 28.57,20.57 v28.32,20.83
  Top 0.203: 27.43,19.43 27.2,19.43 U6.52
  Top 0.254: v11.56,22.35 11.94,22.73 11.94,25.53 12.32,25.91 12.32,31.5 11.68,32.13
  Top 0.508: 11.68,32.13 11.18,32.64 R42.2
  PWR 0.127: v28.32,20.83 28.19,20.95 27.3,20.95 26.92,21.34 25.78,21.34 25.43,20.98 13.72,20.98 12.34,22.35 v11.56,22.35
DCDC4_OUT
  Top 0.203: 21.2,19.82 U6.67 | 21.2,19.82 20.95,20.07 20.83,20.07 21.08,19.82 21.2,19.82
  Top 0.508: 20.07,20.19 20.19,20.07 20.83,20.07 | C101.2 15.49,23.24 DCDC4_OUT.1
  Top 0.762: 20.07,20.19 19.68,20.19 19.05,20.83 18.03,20.83 16.97,21.89 L8.1
  Top 1.016: L8.1 16.97,23.24 C101.2
DLDO1  (via drill 0.5)
  Top 0.203: 21.2,10.79 U6.19
  Top 0.254: 21.2,10.79 20.83,10.41 19.56,10.41 19.3,10.67
  Top 0.508: v18.03,10.67 19.3,10.67
  Bottom 0.508: C125.2 19.68,10.03 19.05,10.67 v18.03,10.67
DLDO2  (via drill 0.5)
  Top 0.203: 19.68,11.94 19.79,12.04 U6.17
  Top 0.406: 19.68,11.94 19.18,11.43 17.65,11.43 17.27,11.05 17.27,10.03 v17.4,9.91
  Bottom 0.406: v17.4,9.91 17.53,9.78 17.53,9.65 17.53,9.4 18.29,8.64 C126.2
DLDO3  (via drill 0.5)
  Top 0.203: 19.43,12.44 U6.16
  Top 0.254: 18.92,12.19 19.05,12.06 19.43,12.44 19.17,12.44 18.92,12.19
  Top 0.508: v17.25,12.06 17.27,12.06 17.4,12.19 18.92,12.19
  Bottom 0.635: v17.25,12.06 16.51,12.06 C128.2 R63.2
DLDO4  (via drill 0.5)
  Top 0.203: 21.6,10.55 U6.20
  Top 0.254: 21.6,10.55 20.95,9.91 19.05,9.91
  Top 0.508: v18.41,9.78 18.54,9.91 19.05,9.91
  Bottom 0.254: 19.3,9.02 18.54,9.78 v18.41,9.78
  Bottom 0.508: C129.2 19.3,9.02
DSI-CKN  (via drill 0.3)
  Top 0.127: U1.U5 32.4,54.83 32.51,54.94 32.51,55.37 v31.62,56.26
  Top 0.152: v60.83,58.17 60.73,58.17 60.21,58.69
  Top 0.254: 60.21,58.69 CSI/DSI.6
  Bottom 0.152: v31.62,56.26 31.93,56.57 31.93,59.74 34.65,62.46 37.19,62.46 40.74,66.02 55.27,66.02 59.44,61.85 59.44,60.76 61.19,59 61.19,58.52 v60.83,58.17
DSI-CKP  (via drill 0.3)
  Top 0.127: U1.T5 32.8,54.3 32.8,55.47 32.26,56.01 v32.26,56.26
  Top 0.152: v60.71,58.8 60.58,58.8 60.2,59.19
  Top 0.254: 60.2,59.19 CSI/DSI.5
  Bottom 0.152: v32.26,56.26 32.26,59.59 34.8,62.13 37.31,62.13 40.87,65.68 55.12,65.68 59.11,61.7 59.11,60.6 60.71,59 v60.71,58.8
DSI-DN0  (via drill 0.3)
  Top 0.127: U1.R4 v33.6,53.5
  Top 0.152: 58.52,57.69 57.84,58.37 57.84,58.93 57.15,59.61 55.42,59.61 v55.37,59.56
  Top 0.254: 58.52,57.69 CSI/DSI.8
  Bottom 0.152: v33.6,53.5 33.6,53.95 34.85,55.2 34.85,58.47 36.2,59.82 38.91,59.82 41.66,62.56 53.37,62.56 55.47,60.45 55.47,59.66 v55.37,59.56
DSI-DN1  (via drill 0.3)
  Top 0.127: U1.R5 v32.8,53.5
  Top 0.152: 58.76,56.69 58.6,56.84 58.09,56.84 56.52,58.42 v56.52,59.05
  Top 0.254: 58.76,56.69 CSI/DSI.10
  Bottom 0.152: v32.8,53.5 32.8,54.14 34.19,55.52 34.19,58.83 35.84,60.48 38.48,60.48 41.43,63.42 53.8,63.42 56.36,60.86 56.36,59.21 v56.52,59.05
DSI-DN2  (via drill 0.3)
  Top 0.127: U1.U6 31.57,54.73 31.57,55.57 v31.6,55.6
  Top 0.152: v60.96,56.64 60.96,56.13 60.51,55.69
  Top 0.254: 60.51,55.69 CSI/DSI.12
  Bottom 0.152: v31.6,55.6 32.23,55.6 32.87,56.24 32.87,59.54 35.13,61.8 37.62,61.8 40.97,65.15 54.86,65.15 58.37,61.65 58.37,60.22 59.82,58.78 59.82,57.78 v60.96,56.64
DSI-DN3  (via drill 0.3)
  Top 0.127: U1.R6 v32,53.5
  Top 0.254: CSI/DSI.14 58.62,54.69 v58.55,54.61
  Bottom 0.152: v32,53.5 32,54.35 33.53,55.88 33.53,59.18 35.48,61.14 38.05,61.14 41.2,64.29 54.33,64.29 57.4,61.21 57.4,59.79 58.65,58.55 58.65,54.71 v58.55,54.61
DSI-DP0  (via drill 0.3)
  Top 0.127: U1.P4 v33.6,52.7
  Top 0.152: 58.53,58.19 58.17,58.55 58.17,59.05 57.28,59.94 55.68,59.94 55.55,60.07 v54.99,60.07
  Top 0.254: 58.53,58.19 CSI/DSI.7
  Bottom 0.127: v33.6,52.7 33.6,52.9 34,53.3 34,53.82
  Bottom 0.152: 34,53.82 34,53.89 35.18,55.07 35.18,58.32 36.35,59.49 39.04,59.49 41.78,62.23 53.21,62.23 54.99,60.45 v54.99,60.07
DSI-DP1  (via drill 0.3)
  Top 0.127: U1.P5 v32.8,52.7
  Top 0.152: v57.02,58.55 57.02,58.37 58.22,57.17 58.77,57.17 58.77,57.19
  Top 0.254: 58.77,57.19 CSI/DSI.9
  Bottom 0.127: v32.8,52.7 33.2,53.1 33.2,53.8
  Bottom 0.152: 33.2,53.8 33.2,54.08 34.52,55.4 34.52,58.67 35.99,60.15 38.61,60.15 41.55,63.09 53.65,63.09 56.03,60.71 56.03,58.9 56.39,58.55 v57.02,58.55
DSI-DP2  (via drill 0.3)
  Top 0.127: U1.T6 32,54.3 v32,55.1
  Top 0.254: CSI/DSI.11 60.38,56.19 v60.45,56.26
  Bottom 0.152: v32,55.1 32.19,55.1 33.2,56.11 33.2,59.38 35.28,61.47 37.74,61.47 41.1,64.82 54.71,64.82 58.04,61.49 58.04,60.07 59.44,58.67 59.44,57.66 60.45,56.64 v60.45,56.26
DSI-DP3  (via drill 0.3)
  Top 0.127: U1.P6 v32,52.7
  Top 0.254: v58.17,55.12 58.23,55.19 CSI/DSI.13
  Bottom 0.127: v32,52.7 32.4,53.1 32.4,53.79
  Bottom 0.152: 32.4,53.79 32.4,54.3 33.86,55.75 33.86,59.03 35.64,60.81 38.18,60.81 41.33,63.96 54.18,63.96 57.07,61.06 57.07,59.64 58.32,58.4 58.32,55.27 v58.17,55.12
ELDO1  (via drill 0.4)
  Top 0.203: 20.69,19.19 U6.68
  Top 0.254: v20.19,19.3 20.31,19.19 20.69,19.19
  Bottom 0.508: C131.2 v20.19,19.3
ELDO3  (via drill 0.4)
  Top 0.203: 19.32,17.64 U6.3
  Top 0.254: 19.32,17.64 18.54,18.41 17.53,18.41 v17.4,18.54
  Bottom 0.254: v17.4,18.54 17.14,18.29 16.51,18.29 15.75,17.53 C133.2
GND  (via drill 0.3, 0.4, 0.5, 0.6)
  Top 0.127: U1.N4 v33.6,51.9 | U1.K7 v30.4,48.7 U1.J7 | v43.2,54.4 U3.A1 | v42.4,60 U3.A8 | v44.8,60 U3.D8 | U3.F2 v47.2,54.4 | U3.F8 v46.4,59.2 | U3.J1 v49.6,53.6 | U3.N1 52.76,54.36 v52.83,54.36 | v49.6,60.8 U3.J9 | v51.2,60.8 U3.L9 | v52.8,60.8 U3.N9 | v44.8,60.8 U3.C9 | v43.2,53.6 U3.B1 | v45.6,53.6 U3.D1 | v45.6,60.8 U3.D9 | v44,54.4 U3.B2 | v43.2,60 U3.B8 | U1.L8 v30.4,50.3 U1.M8 | v42.4,42.2 U2.A8 | U2.D9 v44.8,43 | v44,42.2 U2.C9 | v43.2,42.2 U2.B8 | v44.8,42.2 U2.D8 | U2.F8 v47.2,42.2 | U2.J9 v49.6,43 | U2.L9 v51.2,43 | v42.4,35.8 U2.A1 | v43.2,36.6 U2.B2 | v43.2,35.8 U2.B1 | v44.8,35.8 U2.D1 | U2.F2 v46.4,36.6 | v49.6,35.8 U2.J1 | v52.92,36.2 U2.N1 | v51.2,35.8 U2.L1 | U3.L1 v51.2,53.6 | U2.N9 52.78,42.98 v53.14,42.98 | U1.H7 v30.4,47.1 U1.G7 | v28.8,51.1 U1.M9 | U1.H12 v27.2,47.1 U1.G11 | U1.K12 v27.2,48.7 U1.J11 | v29.6,46.3 U1.F8 | v28.8,46.3 U1.F9 | v28.8,45.5 U1.F10 | v29.6,47.1 U1.G8 | v28.8,47.1 U1.G9 | v28,47.1 U1.G10 | v29.6,47.9 U1.H8 | v28.8,47.9 U1.H9 | v28,47.9 U1.H10 | U1.H11 v27.2,47.9 U1.J12 | U1.K8 v29.6,48.7 U1.J8 | U1.J9 v28.8,48.7 U1.K9 | v28,48.7 U1.J10 | U1.K11 v28,49.5 U1.L11 | U1.K10 v28.8,49.5 U1.L9 | U1.L10 v28.8,50.3 U1.M10
  Top 0.203: 27.29,14.84 U6.42 | 24.4,18.52 U6.59 | 21.6,18.53 U6.66 | 24.4,11.96 U6.27 | 24,11.94 U6.26 | 20.84,12.84 U6.15 | 20.72,14.84 U6.10 | 20.64,16.44 U6.6
  Top 0.254: U4.36 39.37,33.79 39.37,33.53 | 30.35,61.21 30.35,57.4 30.99,56.77 v31.11,56.77 31.37,57.02 32.64,57.02 32.89,56.77 32.89,56.01 | v25.91,58.67 25.65,58.42 25.65,57.02 25.53,56.9 25.02,56.9 | 25.65,62.23 25.65,64.26 25.15,64.77 20.95,64.77 20.7,64.52 19.94,64.52 19.56,64.14 v19.56,63.12 19.56,61.72 C68.1 | 19.68,58.67 19.68,57.15 20.07,56.77 v20.95,56.77 v21.59,56.77 22.35,56.77 | v33.05,62.31 32.94,62.2 31.22,62.2 | 38.73,57.78 38.1,57.15 36.7,57.15 36.2,56.64 34.42,56.64 34.16,56.39 34.16,55.75 | 34.67,30.99 37.37,28.29 U4.25 39.37,28.29 39.37,31.24 | 0.64,44.32 0.51,44.2 0.51,39.12 1.4,38.23 | U4.23 17.57,28.79 17.27,29.08 17.27,29.46 16.76,29.97 | R71.2 13.21,31.62 15.75,31.62 16,31.88 | 60.83,59.44 60.58,59.44 60.33,59.69 CSI/DSI.4 58.55,59.69 57.78,60.45 57.28,60.45 | 20.84,12.84 21.08,13.08 21.34,13.08 | 20.72,14.84 21.34,15.46 21.34,15.62 21.34,15.75 20.64,16.44 | 21.6,18.53 21.6,18.02 21.84,17.78 | 24.4,18.52 24.38,18.5 24.38,17.78 | 27.29,14.84 27.27,14.86 26.54,14.86 | 24,11.94 24,12.45 24.13,12.57 24.4,12.3 24.4,11.96 | C15.1 17.02,33.27 17.53,33.79 U4.13 | v17.02,39.12 17.19,39.29 U4.2 20.02,39.29 20.19,39.12 | 42.11,60 v42.4,60 | 42.11,60 41.15,60.96 41.15,61.68 | CSI/DSI.18 58.27,52.69 v58.17,52.58 | CSI/DSI.37 58.03,43.19 v57.91,43.31 | v39.12,39.24 39.12,39.62 38.95,39.79 U4.48 37.97,39.79 | 37.97,39.79 v37.97,40.39 | 37.97,39.79 37.12,39.79 37.08,39.75 | 42.11,60 41.42,59.31 40.64,59.31 40.01,58.67 v40.01,58.55 | 57.84,51.1 58.01,50.93 58.01,49.38 v57.91,49.28 | v47,34.4 47.49,33.91 48.01,33.91 | 55.12,16.13 55.24,16.13 55.88,15.49 55.88,11.68 54.74,10.54 54.74,8.76
  Top 0.305: 19.43,30.1 19.43,30.48 20.19,31.24 21.21,31.24 22.1,32.13 29.59,32.13 29.72,32.26